# Altium project Apollo2.PrjPCB
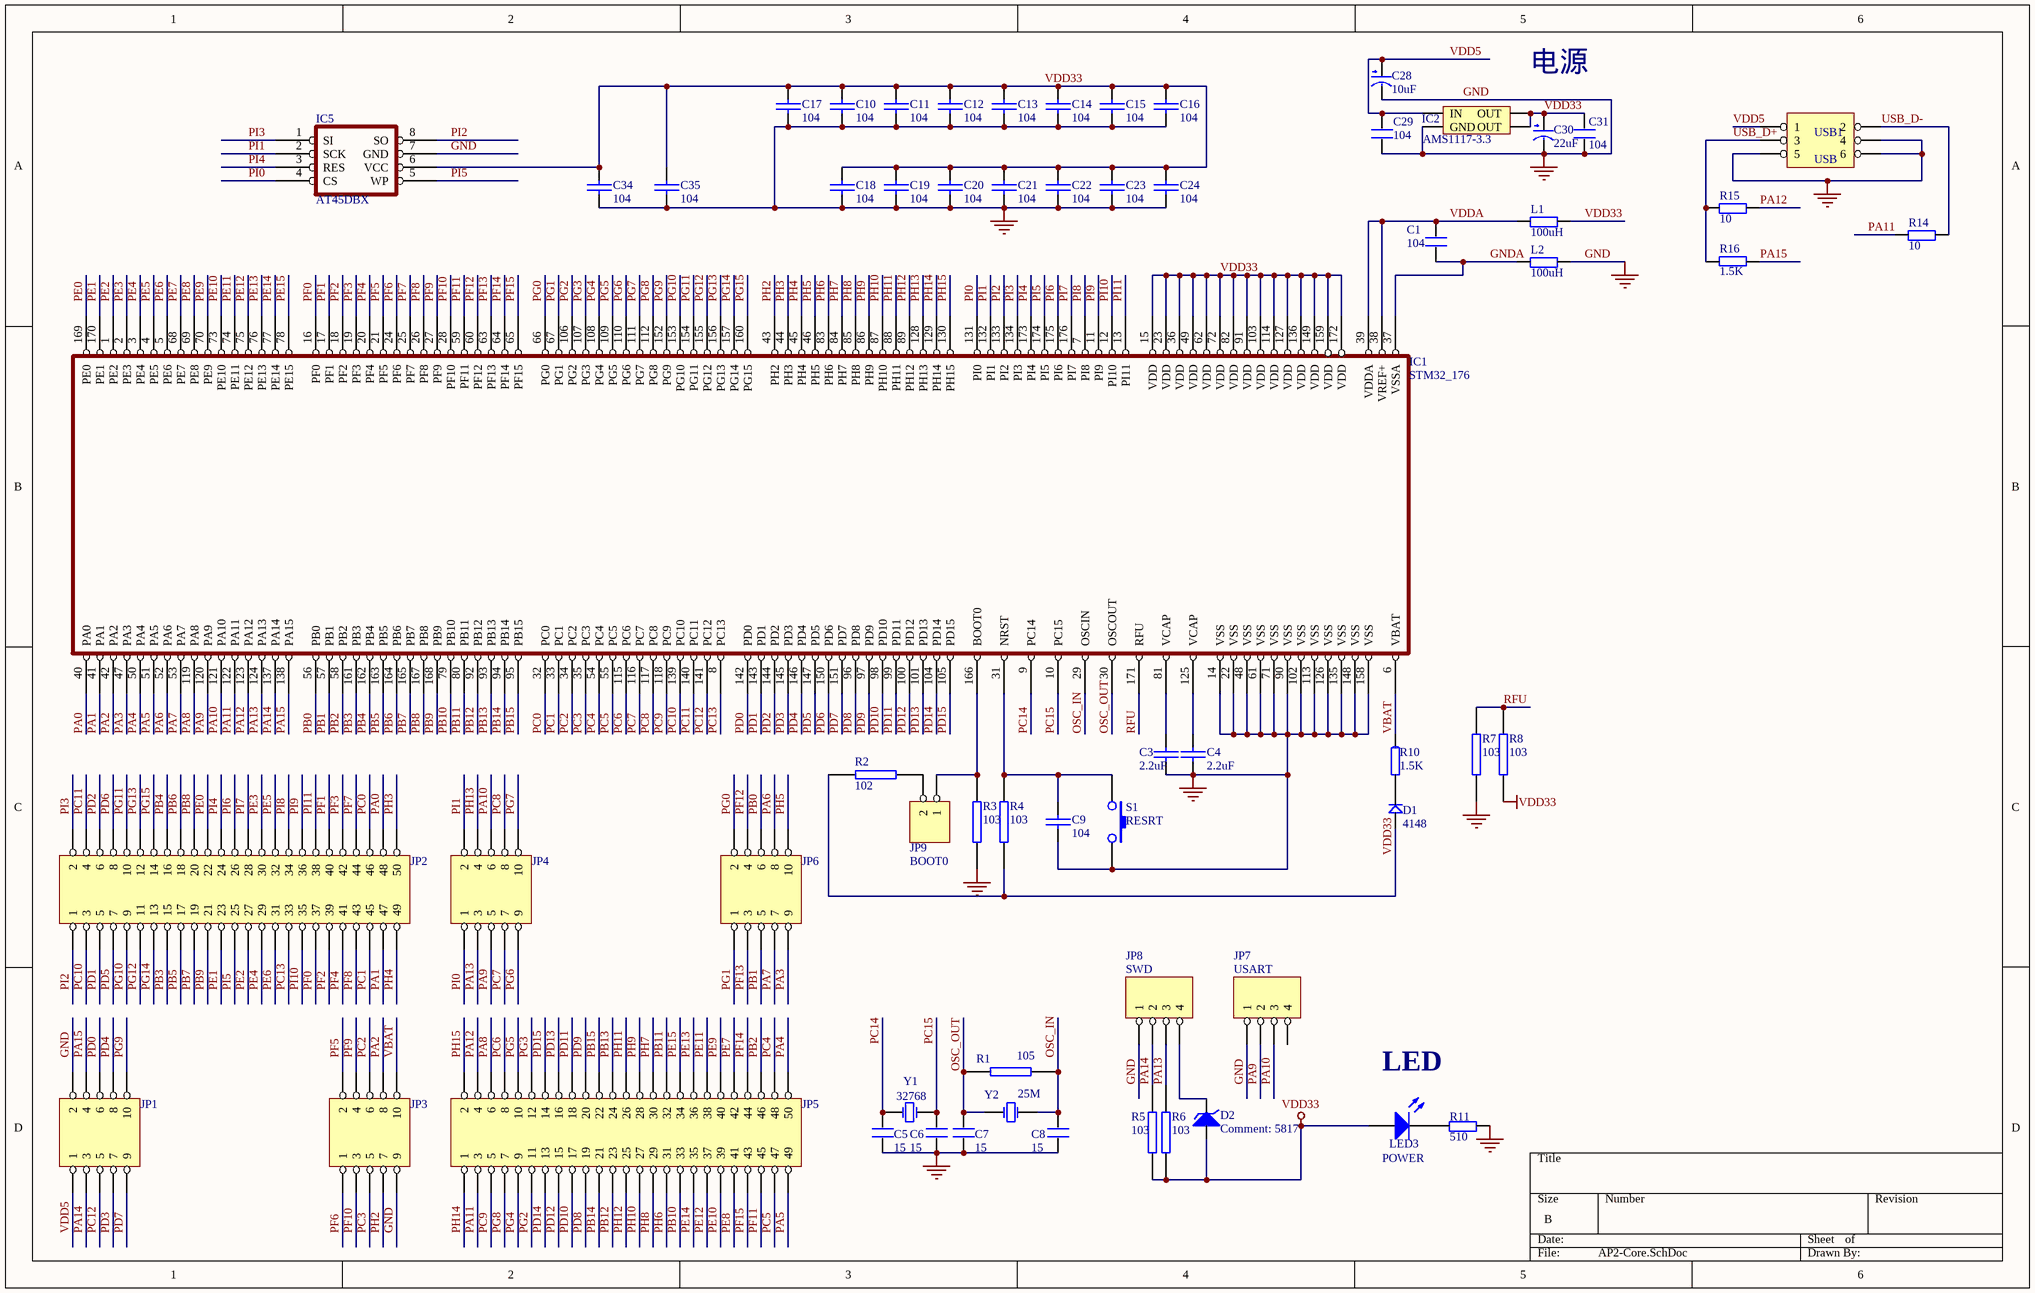
[diagram p0: AP2-Core.SchDoc]
2 sheets, 581 parts. Net scope: global (net labels, ports and power ports of the same name join across sheets).
Board files: AP2-H.PcbDoc, AP2-Core.PcbDoc
Sheets:
  AP2-Core.SchDoc
  AP2-H.SchDoc

## Sheet AP2-Core.SchDoc
size B; SheetNumber: 0; SheetTotal: 0

### Parts
(Parts that share a designator on the sheet are numbered #1, #2 ... from top to bottom, then left to right.)
C1#1  104  [0603P]
C3#1  2.2uF  [3528]
C4#1  2.2uF  [3528]
C5#1  15  [0603P]
C6#1  15  [0603P]
C7#1  15  [0603P]
C8#1  15  [0603P]
C9#1  104  [0603P]
C10#1  104  [0603P]
C11#1  104  [0603P]
C12#1  104  [0603P]
C13#1  104  [0603P]
C14#1  104  [0603P]
C15#1  104  [0603P]
C16  104  [0603P]
C17  104  [0603P]
C18#1  104  [0603P]
C19#1  104  [0603P]
C20#1  104  [0603P]
C21#1  104  [0603P]
C22#1  104  [0603P]
C23#1  104  [0603P]
C24#1  104  [0603P]
C28#1  10uF  [1206C]
C29#1  104  [0603P]
C30#1  22uF  [3528]
C31#1  104  [0603P]
C34#1  104  [0603P]
C35  104  [0603P]
D1#1  4148  [DIODE_SOP]
D2#1  5817  [T5817]
IC1  STM32_176  [LQFP176]
IC2  AMS1117-3.3  [AMS1117]
IC5  AT45DBX  [SOIC-8]
JP1  (no value)
JP2  (no value)
JP3  (no value)
JP4  (no value)
JP5  (no value)
JP6  (no value)
JP7  USART  [SIP3]
JP8  SWD  [SIP4]
JP9  BOOT0
L1#1  100uH  [0805]
L2#1  100uH  [0805]
LED3#1  POWER  [0603P]
R1#1  105  [0603P]
R2#1  102  [0603P]
R3#1  103  [0603P]
R4#1  103  [0603P]
R5#1  103  [0603p]
R6#1  103  [0603P]
R7#1  103  [0603P]
R8#1  103  [0603P]
R10#1  1.5K  [0603P]
R11#1  510  [0603P]
R14#1  10  [0603P]
R15#1  10  [0603P]
R16#1  1.5K  [0603P]
S1  RESRT
USB1#1  USB  [MINI USB D]
Y1#1  32768  [MC-146]
Y2  25M  [XTALV-49USMD]

### Nets
GND: C3#1.2 C4#1.2 C5#1.1 C6#1.1 C7#1.2 C8#1.2 C9#1.2 C10#1.2 C11#1.2 C12#1.2 C13#1.2 C14#1.2 C15#1.2 C16.2 C17.2 C18#1.2 C19#1.2 C20#1.2 C21#1.2 C22#1.2 C23#1.2 C24#1.2 C28#1.2(GND) C29#1.1 C30#1.2(GND) C31#1.1 C34#1.2 C35.2 IC1.14(VSS) IC1.22(VSS) IC1.48(VSS) IC1.61(VSS) IC1.71(VSS) IC1.90(VSS) IC1.102(VSS) IC1.113(VSS) IC1.126(VSS) IC1.135(VSS) IC1.148(VSS) IC1.158(VSS) IC2.1(GND) IC5.7(GND) JP1.2 JP3.9 JP7.1 JP8.1 L2#1.2 R3#1.1 R7#1.1 R11#1.2 S1.2 USB1#1.4 USB1#1.5 USB1#1.6
VDD33: C10#1.1 C11#1.1 C12#1.1 C13#1.1 C14#1.1 C15#1.1 C16.1 C17.1 C18#1.1 C19#1.1 C20#1.1 C21#1.1 C22#1.1 C23#1.1 C24#1.1 C30#1.1(VCC) C31#1.2 C34#1.1 C35.1 D1#1.1 D2#1.A IC1.15(VDD) IC1.23(VDD) IC1.36(VDD) IC1.49(VDD) IC1.62(VDD) IC1.72(VDD) IC1.82(VDD) IC1.91(VDD) IC1.103(VDD) IC1.114(VDD) IC1.127(VDD) IC1.136(VDD) IC1.149(VDD) IC1.159(VDD) IC1.172(VDD) IC2.2(OUT) IC2.4(OUT) IC5.6(VCC) L1#1.2 LED3#1.1(A) R2#1.2 R4#1.1 R5#1.1 R6#1.1 R8#1.1
GNDA: C1#1.1 IC1.37(VSSA) L2#1.1
OSC_IN: C8#1.1 IC1.29(OSCIN) R1#1.2 Y2.1(OSC1)
OSC_OUT: C7#1.1 IC1.30(OSCOUT) R1#1.1 Y2.2(OSC2)
PA0: IC1.40(PA0) JP2.48  [project net CLKOUT]
PA1: IC1.41(PA1) JP2.47  [project net INT]
PA2: IC1.42(PA2) JP3.8
PA3: IC1.47(PA3) JP6.9
PA4: IC1.50(PA4) JP5.50  [project net CS]
PA5: IC1.51(PA5) JP5.49
PA6: IC1.52(PA6) JP6.8
PA7: IC1.53(PA7) JP6.7
PA8: IC1.119(PA8) JP5.6
PA9: IC1.120(PA9) JP4.5 JP7.2
PA10: IC1.121(PA10) JP4.6 JP7.3
PA11: IC1.122(PA11) JP5.3 R14#1.1
PA12: IC1.123(PA12) JP5.4 R15#1.2
PA13: IC1.124(PA13) JP4.3 JP8.3 R6#1.2
PA14: IC1.137(PA14) JP1.3 JP8.2 R5#1.2
PA15: IC1.138(PA15) JP1.4 R16#1.1
PB0: IC1.56(PB0) JP6.6
PB1: IC1.57(PB1) JP6.5
PB2: IC1.58(PB2) JP5.46
PB3: IC1.161(PB3) JP2.15
PB4: IC1.162(PB4) JP2.16
PB5: IC1.163(PB5) JP2.17
PB6: IC1.164(PB6) JP2.18
PB7: IC1.165(PB7) JP2.19
PB8: IC1.167(PB8) JP2.20
PB9: IC1.168(PB9) JP2.21
PB10: IC1.79(PB10) JP5.33
PB11: IC1.80(PB11) JP5.32
PB12: IC1.92(PB12) JP5.23
PB13: IC1.93(PB13) JP5.24
PB14: IC1.94(PB14) JP5.21
PB15: IC1.95(PB15) JP5.22
PC0: IC1.32(PC0) JP2.46
PC1: IC1.33(PC1) JP2.45
PC2: IC1.34(PC2) JP3.6
PC3: IC1.35(PC3) JP3.5
PC4: IC1.54(PC4) JP5.48
PC5: IC1.55(PC5) JP5.47
PC6: IC1.115(PC6) JP5.8
PC7: IC1.116(PC7) JP4.7
PC8: IC1.117(PC8) JP4.8
PC9: IC1.118(PC9) JP5.5
PC10: IC1.139(PC10) JP2.3
PC11: IC1.140(PC11) JP2.4
PC12: IC1.141(PC12) JP1.5
PC13: IC1.8(PC13) JP2.33
PC14: C5#1.2 IC1.9(PC14) Y1#1.1(OSC1)
PC15: C6#1.2 IC1.10(PC15) Y1#1.2(OSC2)
PD0: IC1.142(PD0) JP1.6
PD1: IC1.143(PD1) JP2.5
PD2: IC1.144(PD2) JP2.6
PD3: IC1.145(PD3) JP1.7
PD4: IC1.146(PD4) JP1.8
PD5: IC1.147(PD5) JP2.7
PD6: IC1.150(PD6) JP2.8
PD7: IC1.151(PD7) JP1.9
PD8: IC1.96(PD8) JP5.19
PD9: IC1.97(PD9) JP5.20
PD10: IC1.98(PD10) JP5.17
PD11: IC1.99(PD11) JP5.18
PD12: IC1.100(PD12) JP5.15
PD13: IC1.101(PD13) JP5.16
PD14: IC1.104(PD14) JP5.13
PD15: IC1.105(PD15) JP5.14
PE0: IC1.169(PE0) JP2.22
PE1: IC1.170(PE1) JP2.23
PE2: IC1.1(PE2) JP2.27
PE3: IC1.2(PE3) JP2.30
PE4: IC1.3(PE4) JP2.29
PE5: IC1.4(PE5) JP2.32
PE6: IC1.5(PE6) JP2.31
PE7: IC1.68(PE7) JP5.42
PE8: IC1.69(PE8) JP5.41
PE9: IC1.70(PE9) JP5.40
PE10: IC1.73(PE10) JP5.39
PE11: IC1.74(PE11) JP5.38
PE12: IC1.75(PE12) JP5.37
PE13: IC1.76(PE13) JP5.36
PE14: IC1.77(PE14) JP5.35
PE15: IC1.78(PE15) JP5.34
PF0: IC1.16(PF0) JP2.37
PF1: IC1.17(PF1) JP2.40
PF2: IC1.18(PF2) JP2.39
PF3: IC1.19(PF3) JP2.42
PF4: IC1.20(PF4) JP2.41
PF5: IC1.21(PF5) JP3.2
PF6: IC1.24(PF6) JP3.1
PF7: IC1.25(PF7) JP2.44
PF8: IC1.26(PF8) JP2.43
PF9: IC1.27(PF9) JP3.4
PF10: IC1.28(PF10) JP3.3
PF11: IC1.59(PF11) JP5.45
PF12: IC1.60(PF12) JP6.4
PF13: IC1.63(PF13) JP6.3
PF14: IC1.64(PF14) JP5.44
PF15: IC1.65(PF15) JP5.43
PG0: IC1.66(PG0) JP6.2
PG1: IC1.67(PG1) JP6.1
PG2: IC1.106(PG2) JP5.11
PG3: IC1.107(PG3) JP5.12
PG4: IC1.108(PG4) JP5.9
PG5: IC1.109(PG5) JP5.10
PG6: IC1.110(PG6) JP4.9
PG7: IC1.111(PG7) JP4.10
PG8: IC1.112(PG8) JP5.7
PG9: IC1.152(PG9) JP1.10
PG10: IC1.153(PG10) JP2.9
PG11: IC1.154(PG11) JP2.10
PG12: IC1.155(PG12) JP2.11
PG13: IC1.156(PG13) JP2.12
PG14: IC1.157(PG14) JP2.13
PG15: IC1.160(PG15) JP2.14
PH2: IC1.43(PH2) JP3.7
PH3: IC1.44(PH3) JP2.50
PH4: IC1.45(PH4) JP2.49
PH5: IC1.46(PH5) JP6.10
PH6: IC1.83(PH6) JP5.31
PH7: IC1.84(PH7) JP5.30
PH8: IC1.85(PH8) JP5.29
PH9: IC1.86(PH9) JP5.28
PH10: IC1.87(PH10) JP5.27
PH11: IC1.88(PH11) JP5.26
PH12: IC1.89(PH12) JP5.25
PH13: IC1.128(PH13) JP4.4
PH14: IC1.129(PH14) JP5.1
PH15: IC1.130(PH15) JP5.2
PI0: IC1.131(PI0) IC5.4(CS) JP4.1
PI1: IC1.132(PI1) IC5.2(SCK) JP4.2
PI2: IC1.133(PI2) IC5.8(SO) JP2.1
PI3: IC1.134(PI3) IC5.1(SI) JP2.2
PI4: IC1.173(PI4) IC5.3(RES) JP2.24
PI5: IC1.174(PI5) IC5.5(WP) JP2.25
PI6: IC1.175(PI6) JP2.26
PI7: IC1.176(PI7) JP2.28
PI8: IC1.7(PI8) JP2.34
PI9: IC1.11(PI9) JP2.36
PI10: IC1.12(PI10) JP2.35
PI11: IC1.13(PI11) JP2.38
RFU: IC1.171(RFU) R7#1.2 R8#1.2
USB_D+: R15#1.1 R16#1.2 USB1#1.3
USB_D-: R14#1.2 USB1#1.2
VBAT: IC1.6(VBAT) JP3.10 R10#1.1
VDD5: C28#1.1(VCC) C29#1.2 IC2.3(IN) JP1.1 USB1#1.1
VDDA: C1#1.2 IC1.38(VREF+) IC1.39(VDDA) L1#1.1
NetC3#1_1: C3#1.1 IC1.81(VCAP)
NetC4#1_1: C4#1.1 IC1.125(VCAP)
NetC9#1_1: C9#1.1 IC1.31(NRST) R4#1.2 S1.1
NetD1#1_2: D1#1.2 R10#1.2
NetD2#1_K: D2#1.K JP8.4
NetIC1_166: IC1.166(BOOT0) JP9.1 R3#1.2
NetJP9_2: JP9.2 R2#1.1
NetLED3#1_2: LED3#1.2(K) R11#1.1

Not connected (* = marked no-connect by the designer): JP7 4

### Notes on the sheet
- 电源
- LED

### Library data of the parts
C1#1 C5#1 C6#1 C7#1 C8#1 C29#1 C31#1 = C
C3#1 C4#1 C9#1 C10#1 C11#1 C12#1 C13#1 C14#1 C15#1 C16 C17 C18#1 C19#1 C20#1 C21#1 C22#1 C23#1 C24#1 C34#1 C35 = CAP: Capacitor
C28#1 C30#1 = CAP
D1#1 = D: 1N4148
D2#1 = ZENER4: Zener Diode
IC2 = AMS1117
JP1 JP3 JP4 JP6 = HEADER 5X2
JP2 JP5 = HEADER 25X2
JP7 JP8 = 4 HEADER: 4 Pin Header
JP9 = HEADER 2
L1#1 L2#1 R10#1 R11#1 R14#1 R15#1 R16#1 = R
LED3#1 = LED2: Typical RED, GREEN, YELLOW, AMBER GaAs LED; Published: *; LatestRevisionDate: *; LatestRevisionNote: *; PackageDocument: *; PackageReference: *; Publisher: *
R1#1 R2#1 R3#1 R4#1 R5#1 R6#1 R7#1 R8#1 = RES2
S1 = SW-PB
USB1#1 = HEADER 3X2
Y1#1 Y2 = XTAL: Crystal Oscillator; Published: *; LatestRevisionDate: *; LatestRevisionNote: *; Publisher: *

## Sheet AP2-H.SchDoc: 阿波罗二号工业控制器Apollo2-64MR底板
size A1; Author: 大石头; CompanyName: 东莞市月无声电子设备有限公司; DocumentName: Ap2-64MR; ProjectName: Ap2-64MR
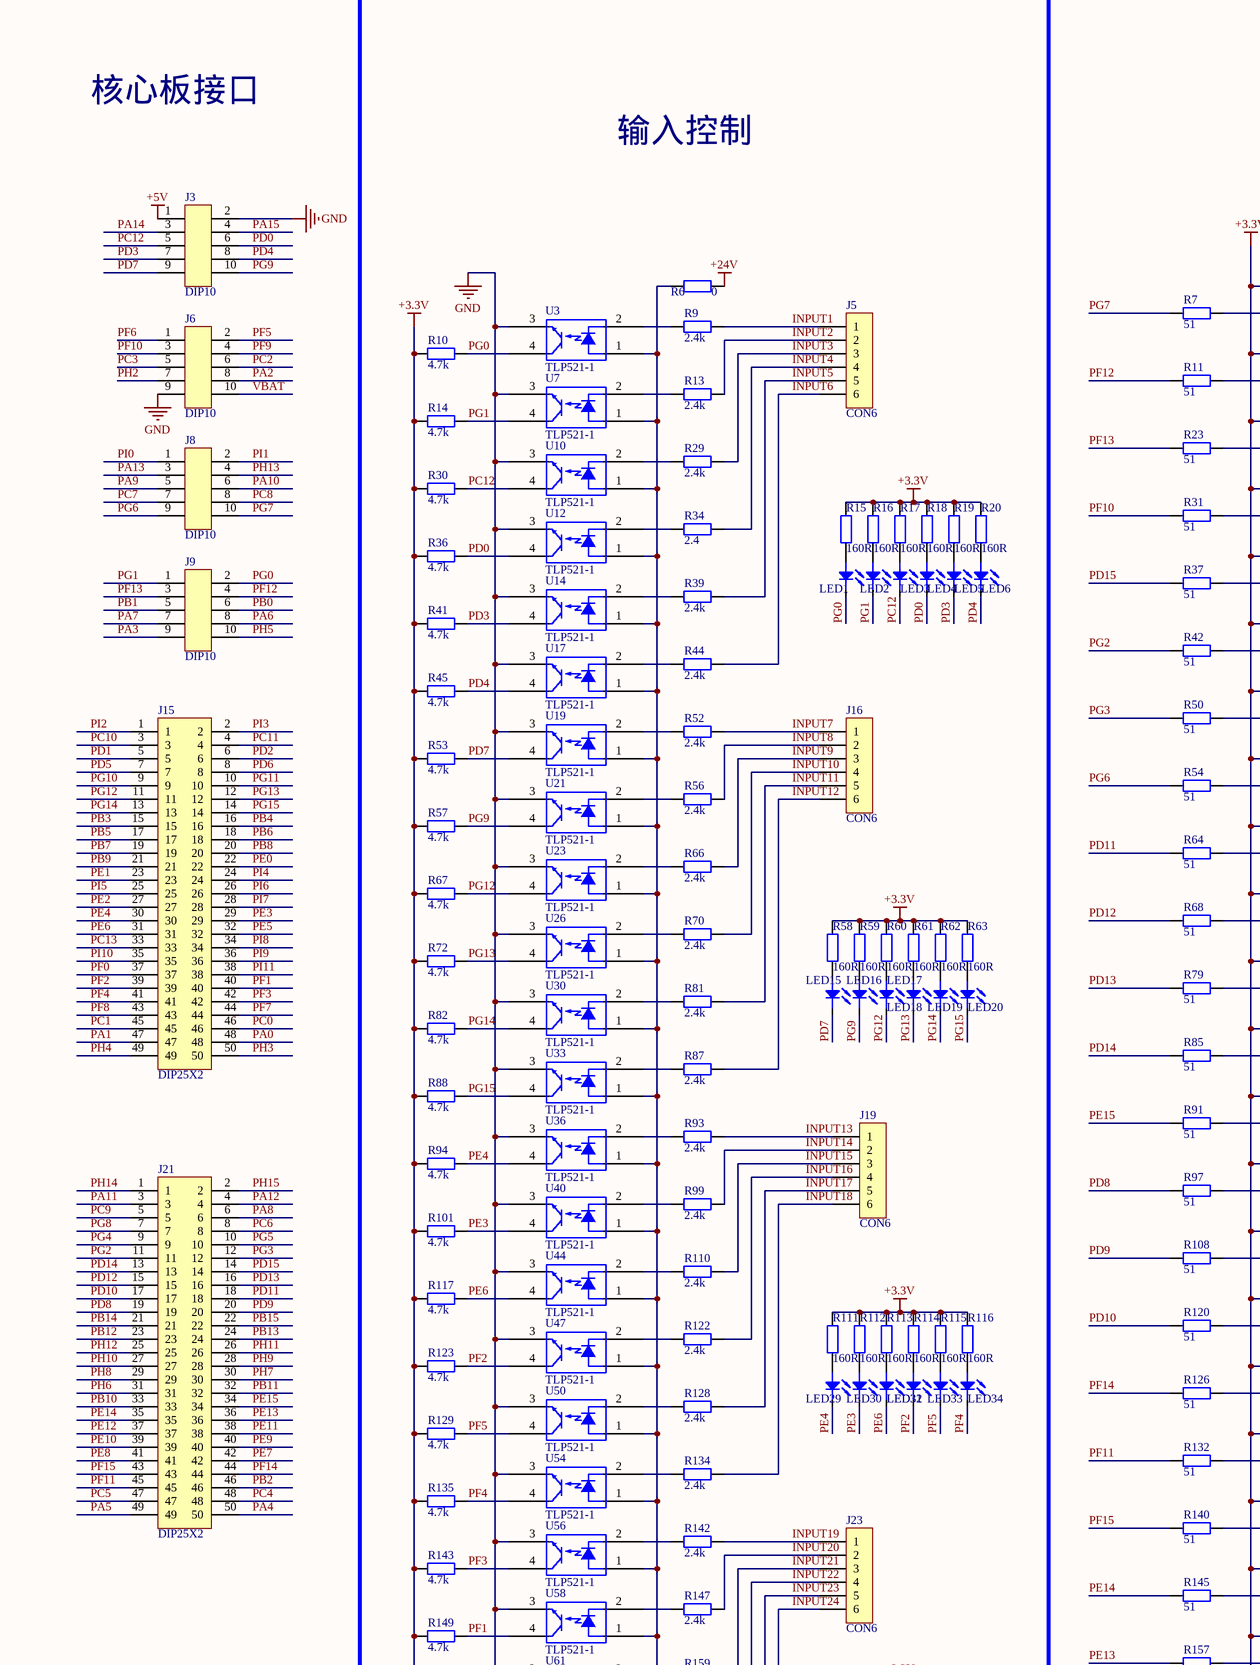
[diagram p1: AP2-H.SchDoc, top left]
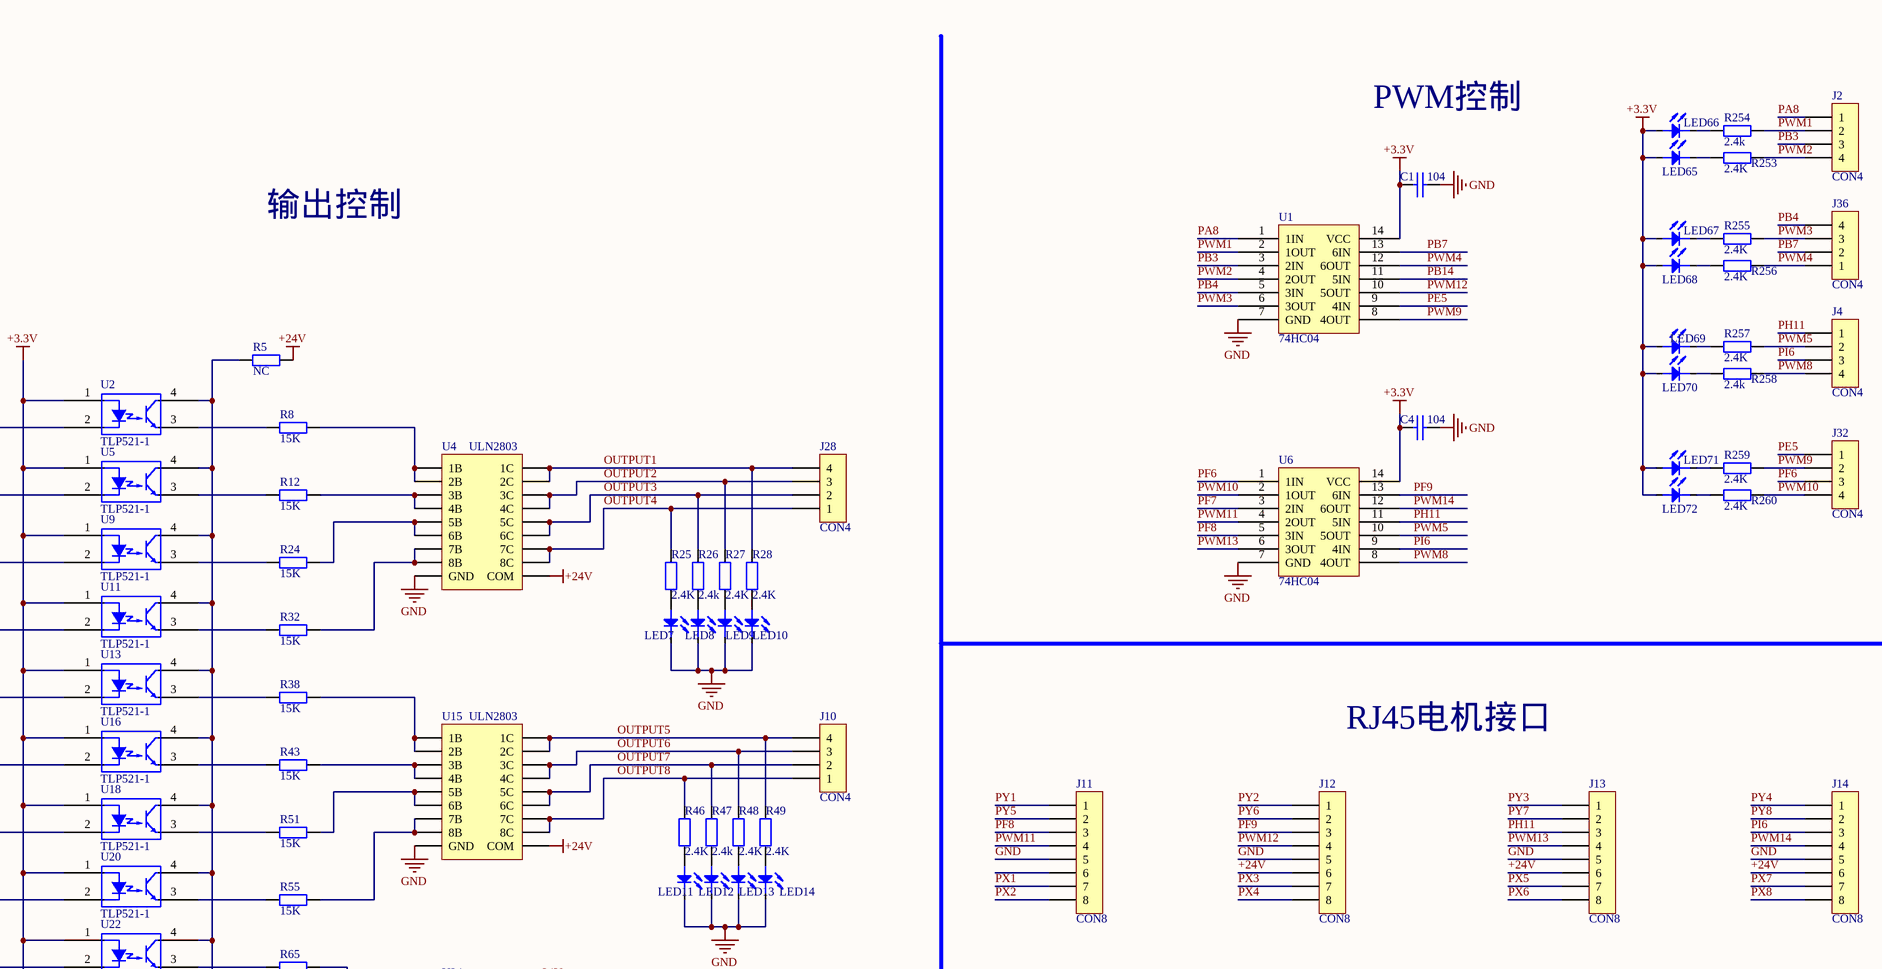
[diagram p2: AP2-H.SchDoc, top middle]
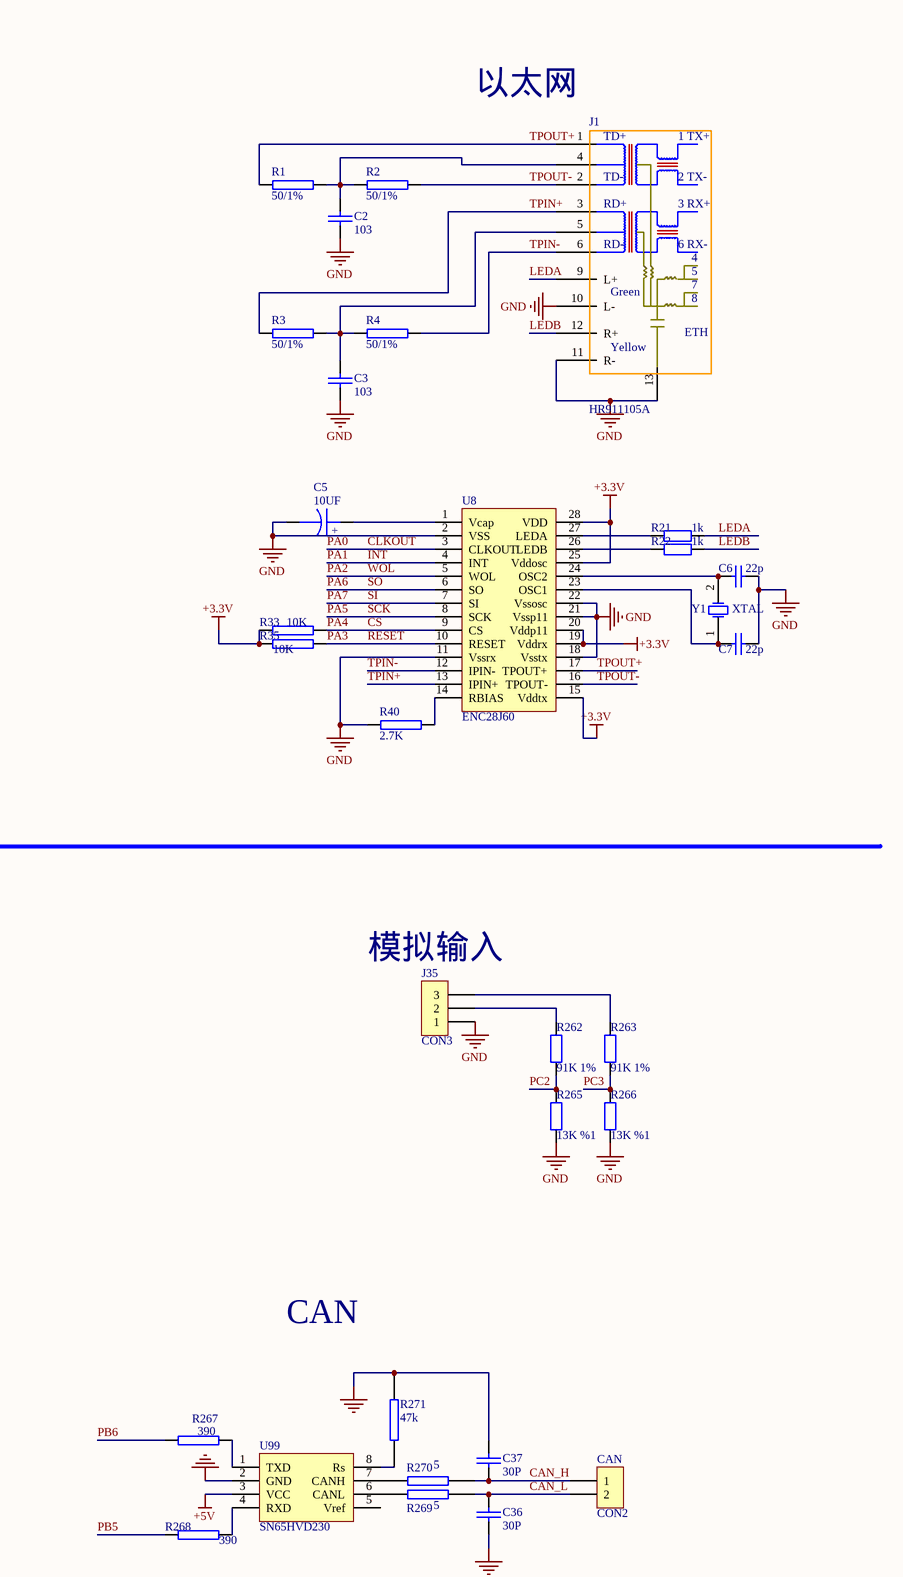
[diagram p3: AP2-H.SchDoc, top right]
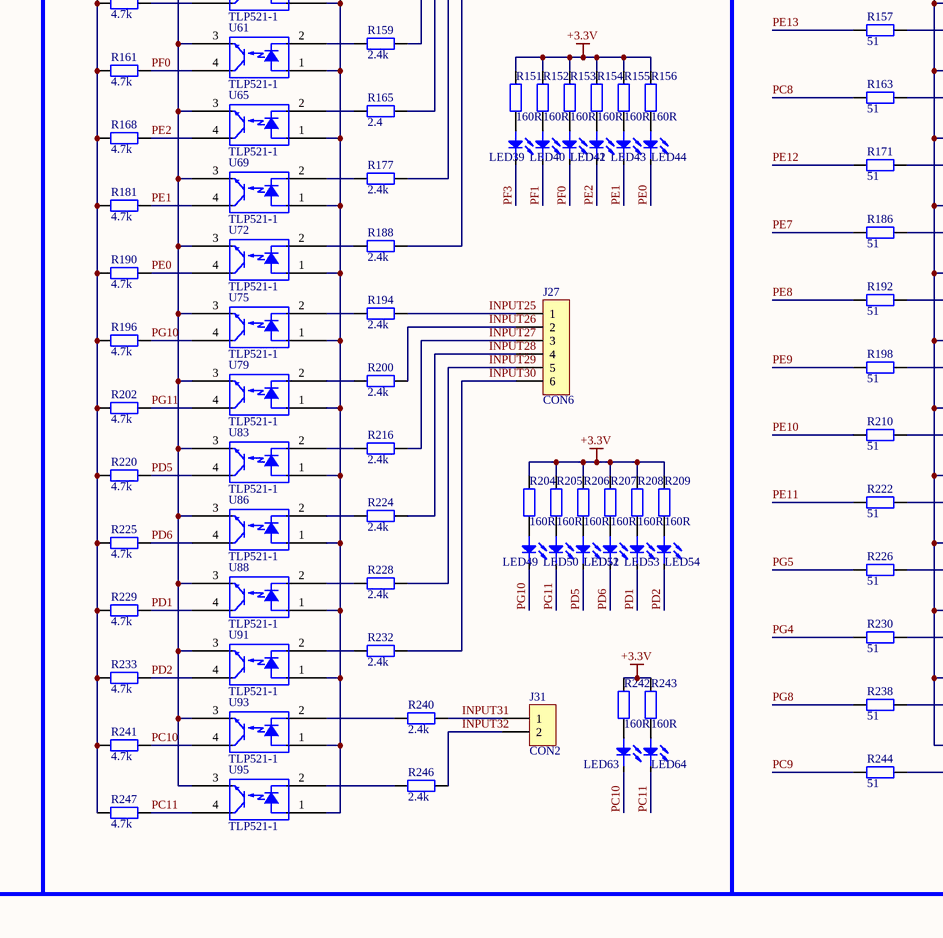
[diagram p4: AP2-H.SchDoc, bottom left]
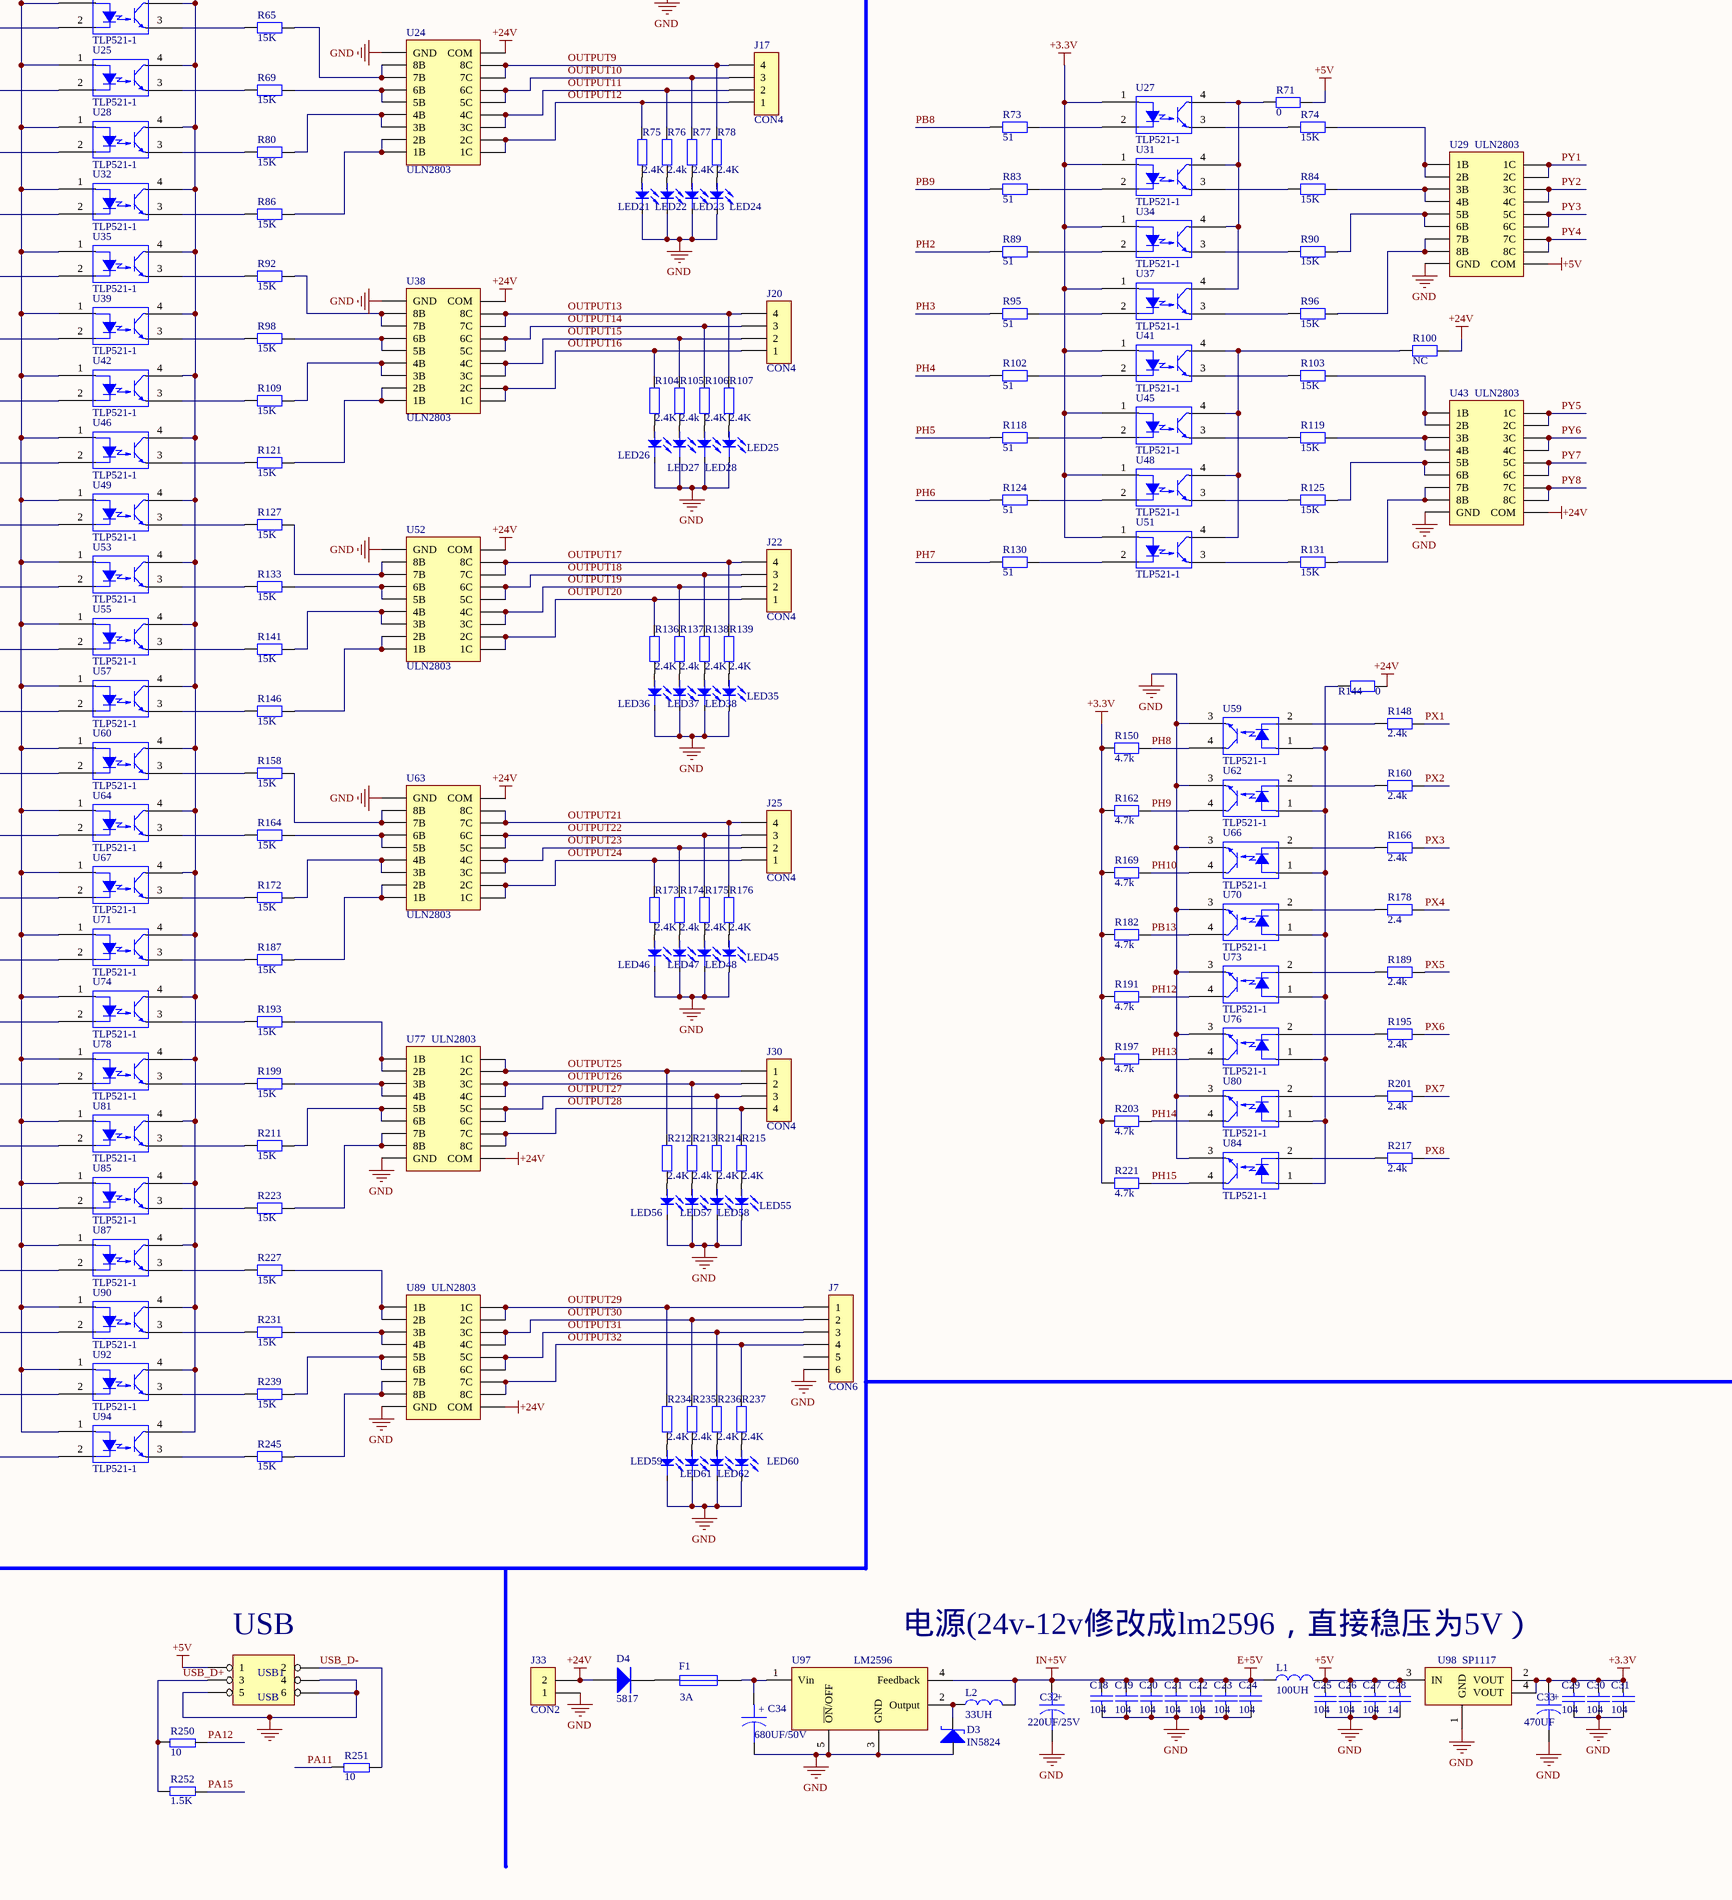
[diagram p5: AP2-H.SchDoc, bottom middle]
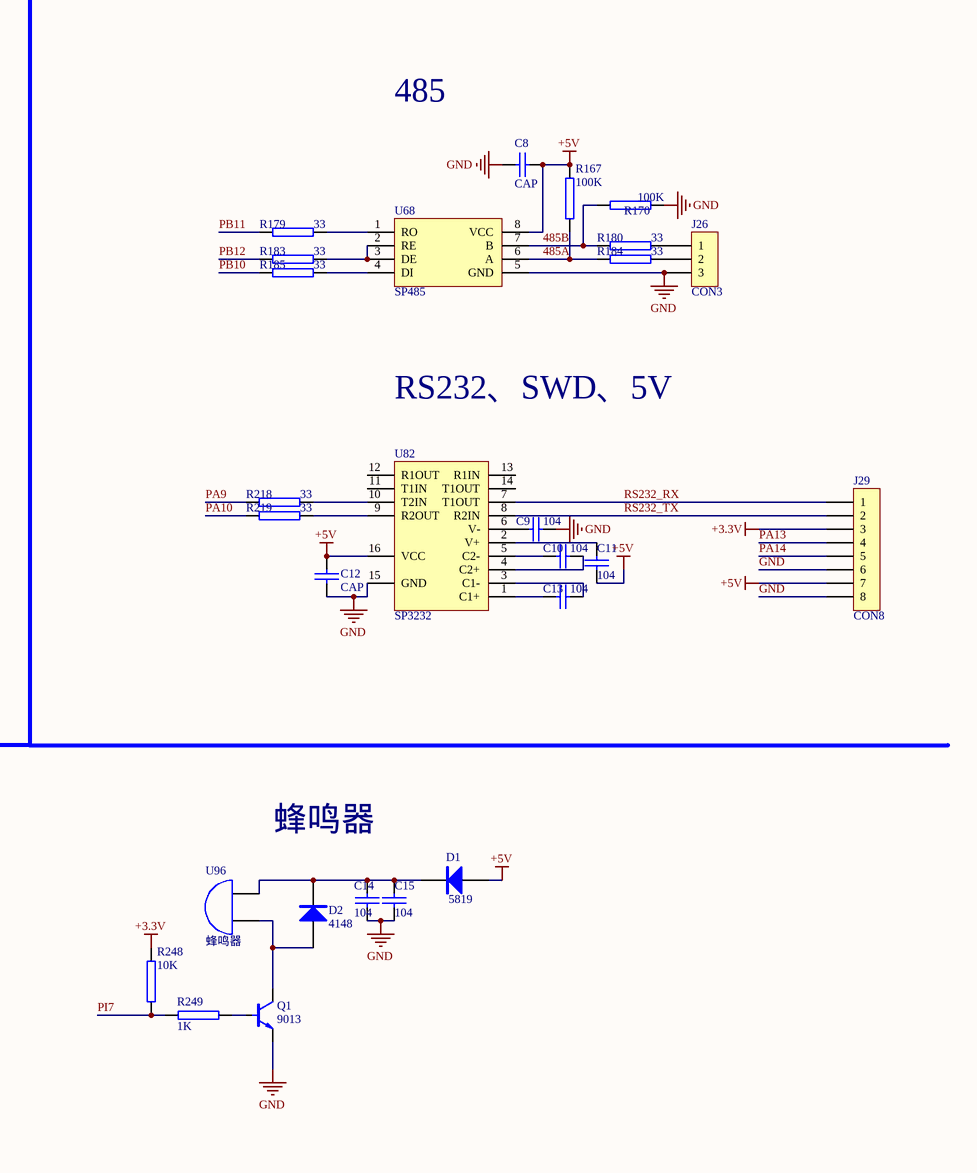
[diagram p6: AP2-H.SchDoc, bottom right]

### Parts
(Parts that share a designator on the sheet are numbered #1, #2 ... from top to bottom, then left to right.)
C1#2  104  [0603]
C2  103  [0603]
C3#2  103  [0603]
C4#2  104  [0603]
C5#2  10UF  [胆电容]
C6#2  22p  [0603]
C7#2  22p  [0603]
C8#2  CAP  [0603]
C9#2  104  [0603]
C10#2  104  [0603]
C11#2  104  [0603]
C12#2  CAP  [0603]
C13#2  104  [0603]
C14#2  104  [0603]
C15#2  104  [0603]
C18#2  104  [0603]
C19#2  104  [0603]
C20#2  104  [0603]
C21#2  104  [0603]
C22#2  104  [0603]
C23#2  104  [0603]
C24#2  104  [0603]
C25  104  [0603]
C26  104  [0603]
C27  104  [0603]
C28#2  14  [0603]
C29#2  104  [0603]
C30#2  104  [0603]
C31#2  104  [0603]
C32  220UF/25V  [固态电容]
C33  470UF  [固态电容]
C34#2  680UF/50V  [固态电容]
C36  30P  [0603]
C37  30P  [0603]
CAN  CON2  [CON2*5]
D1#2  5819  [贴片二极管]
D2#2  4148  [贴片二极管]
D3  IN5824  [贴片二极管]
D4  5817  [贴片二极管]
F1  3A  [自恢复保险丝]
J1  HR911105A  [HR911105A]
J2  CON4  [CON4*5]
J3  DIP10  [DIP2.0-10]
J4  CON4  [CON4*5]
J5  CON6  [CON6*5]
J6  DIP10  [DIP2.0-10]
J7  CON6  [CON6*5]
J8  DIP10  [DIP2.0-10]
J9  DIP10  [DIP2.0-10]
J10  CON4  [CON4*5]
J11  CON8  [立式RJ45]
J12  CON8  [立式RJ45]
J13  CON8  [立式RJ45]
J14  CON8  [立式RJ45]
J15  DIP25X2  [DIP2.0-50]
J16  CON6  [CON6*5]
J17  CON4  [CON4*5]
J19  CON6  [CON6*5]
J20  CON4  [CON4*5]
J21  DIP25X2  [DIP2.0-50]
J22  CON4  [CON4*5]
J23  CON6  [CON6*5]
J25  CON4  [CON4*5]
J26  CON3  [CON3*5]
J27  CON6  [CON6*5]
J28  CON4  [CON4*5]
J29  CON8  [OD-RJ45]
J30  CON4  [CON4*5]
J31  CON2  [CON2*5]
J32  CON4  [CON4*5]
J33  CON2  [CON2*5]
J35  CON3  [CON3*5]
J36  CON4  [CON4*5]
L1#2  100UH  [SMD-48]
L2#2  33UH  [SMD-48]
LED1  LED  [LED2.5]  (value not drawn)
LED2  LED  [LED2.5]  (value not drawn)
LED3#2  LED  [LED2.5]  (value not drawn)
LED4  LED  [LED2.5]  (value not drawn)
LED5  LED  [LED2.5]  (value not drawn)
LED6  LED  [LED2.5]  (value not drawn)
LED7  LED  [LED2.5]  (value not drawn)
LED8  LED  [LED2.5]  (value not drawn)
LED9  LED  [LED2.5]  (value not drawn)
LED10  LED  [LED2.5]  (value not drawn)
LED11  LED  [LED2.5]  (value not drawn)
LED12  LED  [LED2.5]  (value not drawn)
LED13  LED  [LED2.5]  (value not drawn)
LED14  LED  [LED2.5]  (value not drawn)
LED15  LED  [LED2.5]  (value not drawn)
LED16  LED  [LED2.5]  (value not drawn)
LED17  LED  [LED2.5]  (value not drawn)
LED18  LED  [LED2.5]  (value not drawn)
LED19  LED  [LED2.5]  (value not drawn)
LED20  LED  [LED2.5]  (value not drawn)
LED21  LED  [LED2.5]  (value not drawn)
LED22  LED  [LED2.5]  (value not drawn)
LED23  LED  [LED2.5]  (value not drawn)
LED24  LED  [LED2.5]  (value not drawn)
LED25  LED  [LED2.5]  (value not drawn)
LED26  LED  [LED2.5]  (value not drawn)
LED27  LED  [LED2.5]  (value not drawn)
LED28  LED  [LED2.5]  (value not drawn)
LED29  LED  [LED2.5]  (value not drawn)
LED30  LED  [LED2.5]  (value not drawn)
LED31  LED  [LED2.5]  (value not drawn)
LED32  LED  [LED2.5]  (value not drawn)
LED33  LED  [LED2.5]  (value not drawn)
LED34  LED  [LED2.5]  (value not drawn)
LED35  LED  [LED2.5]  (value not drawn)
LED36  LED  [LED2.5]  (value not drawn)
LED37  LED  [LED2.5]  (value not drawn)
LED38  LED  [LED2.5]  (value not drawn)
LED39  LED  [LED2.5]  (value not drawn)
LED40  LED  [LED2.5]  (value not drawn)
LED41  LED  [LED2.5]  (value not drawn)
LED42  LED  [LED2.5]  (value not drawn)
LED43  LED  [LED2.5]  (value not drawn)
LED44  LED  [LED2.5]  (value not drawn)
LED45  LED  [LED2.5]  (value not drawn)
LED46  LED  [LED2.5]  (value not drawn)
LED47  LED  [LED2.5]  (value not drawn)
LED48  LED  [LED2.5]  (value not drawn)
LED49  LED  [LED2.5]  (value not drawn)
LED50  LED  [LED2.5]  (value not drawn)
LED51  LED  [LED2.5]  (value not drawn)
LED52  LED  [LED2.5]  (value not drawn)
LED53  LED  [LED2.5]  (value not drawn)
LED54  LED  [LED2.5]  (value not drawn)
LED55  LED  [LED2.5]  (value not drawn)
LED56  LED  [LED2.5]  (value not drawn)
LED57  LED  [LED2.5]  (value not drawn)
LED58  LED  [LED2.5]  (value not drawn)
LED59  LED  [LED2.5]  (value not drawn)
LED60  LED  [LED2.5]  (value not drawn)
LED61  LED  [LED2.5]  (value not drawn)
LED62  LED  [LED2.5]  (value not drawn)
LED63  LED  [LED2.5]  (value not drawn)
LED64  LED  [LED2.5]  (value not drawn)
LED65  LED  [LED2.5]  (value not drawn)
LED66  LED  [LED2.5]  (value not drawn)
LED67  LED  [LED2.5]  (value not drawn)
LED68  LED  [LED2.5]  (value not drawn)
LED69  LED  [LED2.5]  (value not drawn)
LED70  LED  [LED2.5]  (value not drawn)
LED71  LED  [LED2.5]  (value not drawn)
LED72  LED  [LED2.5]  (value not drawn)
Q1  9013  [SOT23]
R1#2  50/1%  [0603]
R2#2  50/1%  [0603]
R3#2  50/1%  [0603]
R4#2  50/1%  [0603]
R5#2  NC  [0805]
R6#2  0  [0805]
R7#2  51  [0603]
R8#2  15K  [0603]
R9  2.4k  [0603]
R10#2  4.7k  [0603]
R11#2  51  [0603]
R12  15K  [0603]
R13  2.4k  [0603]
R14#2  4.7k  [0603]
R15#2  160R  [0603]
R16#2  160R  [0603]
R17  160R  [0603]
R18  160R  [0603]
R19  160R  [0603]
R20  160R  [0603]
R21  1k  [0603]
R22  1k  [0603]
R23  51  [0603]
R24  15K  [0603]
R25  2.4K  [0603]
R26  2.4k  [0603]
R27  2.4K  [0603]
R28  2.4K  [0603]
R29  2.4k  [0603]
R30  4.7k  [0603]
R31  51  [0603]
R32  15K  [0603]
R33  10K  [0603]
R34  2.4  [0603]
R35  10K  [0603]
R36  4.7k  [0603]
R37  51  [0603]
R38  15K  [0603]
R39  2.4k  [0603]
R40  2.7K  [0603]
R41  4.7k  [0603]
R42  51  [0603]
R43  15K  [0603]
R44  2.4k  [0603]
R45  4.7k  [0603]
R46  2.4K  [0603]
R47  2.4k  [0603]
R48  2.4K  [0603]
R49  2.4K  [0603]
R50  51  [0603]
R51  15K  [0603]
R52  2.4k  [0603]
R53  4.7k  [0603]
R54  51  [0603]
R55  15K  [0603]
R56  2.4k  [0603]
R57  4.7k  [0603]
R58  160R  [0603]
R59  160R  [0603]
R60  160R  [0603]
R61  160R  [0603]
R62  160R  [0603]
R63  160R  [0603]
R64  51  [0603]
R65  15K  [0603]
R66  2.4k  [0603]
R67  4.7k  [0603]
R68  51  [0603]
R69  15K  [0603]
R70  2.4k  [0603]
R71  0  [0805]
R72  4.7k  [0603]
R73  51  [0603]
R74  15K  [0603]
R75  2.4K  [0603]
R76  2.4k  [0603]
R77  2.4K  [0603]
R78  2.4K  [0603]
R79  51  [0603]
R80  15K  [0603]
R81  2.4k  [0603]
R82  4.7k  [0603]
R83  51  [0603]
R84  15K  [0603]
R85  51  [0603]
R86  15K  [0603]
R87  2.4k  [0603]
R88  4.7k  [0603]
R89  51  [0603]
R90  15K  [0603]
R91  51  [0603]
R92  15K  [0603]
R93  2.4k  [0603]
R94  4.7k  [0603]
R95  51  [0603]
R96  15K  [0603]
R97  51  [0603]
R98  15K  [0603]
R99  2.4k  [0603]
R100  NC  [0805]
R101  4.7k  [0603]
R102  51  [0603]
R103  15K  [0603]
R104  2.4K  [0603]
R105  2.4k  [0603]
R106  2.4K  [0603]
R107  2.4K  [0603]
R108  51  [0603]
R109  15K  [0603]
R110  2.4k  [0603]
R111  160R  [0603]
R112  160R  [0603]
R113  160R  [0603]
R114  160R  [0603]
R115  160R  [0603]
R116  160R  [0603]
R117  4.7k  [0603]
R118  51  [0603]
R119  15K  [0603]
R120  51  [0603]
R121  15K  [0603]
R122  2.4k  [0603]
R123  4.7k  [0603]
R124  51  [0603]
R125  15K  [0603]
R126  51  [0603]
R127  15K  [0603]
R128  2.4k  [0603]
R129  4.7k  [0603]
R130  51  [0603]
R131  15K  [0603]
R132  51  [0603]
R133  15K  [0603]
R134  2.4k  [0603]
R135  4.7k  [0603]
R136  2.4K  [0603]
R137  2.4k  [0603]
R138  2.4K  [0603]
R139  2.4K  [0603]
R140  51  [0603]
R141  15K  [0603]
R142  2.4k  [0603]
R143  4.7k  [0603]
R144  0  [0805]
R145  51  [0603]
R146  15K  [0603]
R147  2.4k  [0603]
R148  2.4k  [0603]
R149  4.7k  [0603]
R150  4.7k  [0603]
R151  160R  [0603]
R152  160R  [0603]
R153  160R  [0603]
R154  160R  [0603]
R155  160R  [0603]
R156  160R  [0603]
R157  51  [0603]
R158  15K  [0603]
R159  2.4k  [0603]
R160  2.4k  [0603]
R161  4.7k  [0603]
R162  4.7k  [0603]
R163  51  [0603]
R164  15K  [0603]
R165  2.4  [0603]
R166  2.4k  [0603]
R167  100K  [0603]
R168  4.7k  [0603]
R169  4.7k  [0603]
R170  100K  [0603]
R171  51  [0603]
R172  15K  [0603]
R173  2.4K  [0603]
R174  2.4k  [0603]
R175  2.4K  [0603]
R176  2.4K  [0603]
R177  2.4k  [0603]
R178  2.4  [0603]
R179  33  [0603]
R180  33  [0603]
R181  4.7k  [0603]
R182  4.7k  [0603]
R183  33  [0603]
R184  33  [0603]
R185  33  [0603]
R186  51  [0603]
R187  15K  [0603]
R188  2.4k  [0603]
R189  2.4k  [0603]
R190  4.7k  [0603]
R191  4.7k  [0603]
R192  51  [0603]
R193  15K  [0603]
R194  2.4k  [0603]
R195  2.4k  [0603]
R196  4.7k  [0603]
R197  4.7k  [0603]
R198  51  [0603]
R199  15K  [0603]
R200  2.4k  [0603]
R201  2.4k  [0603]
R202  4.7k  [0603]
R203  4.7k  [0603]
R204  160R  [0603]
R205  160R  [0603]
R206  160R  [0603]
R207  160R  [0603]
R208  160R  [0603]
R209  160R  [0603]
R210  51  [0603]
R211  15K  [0603]
R212  2.4K  [0603]
R213  2.4k  [0603]
R214  2.4K  [0603]
R215  2.4K  [0603]
R216  2.4k  [0603]
R217  2.4k  [0603]
R218  33  [0603]
R219  33  [0603]
R220  4.7k  [0603]
R221  4.7k  [0603]
R222  51  [0603]
R223  15K  [0603]
R224  2.4k  [0603]
R225  4.7k  [0603]
R226  51  [0603]
R227  15K  [0603]
R228  2.4k  [0603]
R229  4.7k  [0603]
R230  51  [0603]
R231  15K  [0603]
R232  2.4k  [0603]
R233  4.7k  [0603]
R234  2.4K  [0603]
R235  2.4k  [0603]
R236  2.4K  [0603]
R237  2.4K  [0603]
R238  51  [0603]
R239  15K  [0603]
R240  2.4k  [0603]
R241  4.7k  [0603]
R242  160R  [0603]
R243  160R  [0603]
R244  51  [0603]
R245  15K  [0603]
R246  2.4k  [0603]
R247  4.7k  [0603]
R248  10K  [0603]
R249  1K  [0603]
R250  10  [0603]
R251  10  [0603]
R252  1.5K  [0603]
R253  2.4K  [0603]
R254  2.4k  [0603]
R255  2.4K  [0603]
R256  2.4K  [0603]
R257  2.4K  [0603]
R258  2.4k  [0603]
R259  2.4K  [0603]
R260  2.4K  [0603]
R262  91K 1%  [0603]
R263  91K 1%  [0603]
R265  13K %1  [0603]
R266  13K %1  [0603]
R267  390  [0603]
R268  390  [0603]
R269  5  [0603]
R270  5  [0603]
R271  47k  [0603]
U1  74HC04  [so-14]
U2  TLP521-1  [PC817]
U3  TLP521-1  [PC817]
U4  ULN2803  [sol18]
U5  TLP521-1  [PC817]
U6  74HC04  [so-14]
U7  TLP521-1  [PC817]
U8  ENC28J60  [SOIC28]
U9  TLP521-1  [PC817]
U10  TLP521-1  [PC817]
U11  TLP521-1  [PC817]
U12  TLP521-1  [PC817]
U13  TLP521-1  [PC817]
U14  TLP521-1  [PC817]
U15  ULN2803  [sol18]
U16  TLP521-1  [PC817]
U17  TLP521-1  [PC817]
U18  TLP521-1  [PC817]
U19  TLP521-1  [PC817]
U20  TLP521-1  [PC817]
U21  TLP521-1  [PC817]
U22  TLP521-1  [PC817]
U23  TLP521-1  [PC817]
U24  ULN2803  [sol18]
U25  TLP521-1  [PC817]
U26  TLP521-1  [PC817]
U27  TLP521-1  [PC817]
U28  TLP521-1  [PC817]
U29  ULN2803  [sol18]
U30  TLP521-1  [PC817]
U31  TLP521-1  [PC817]
U32  TLP521-1  [PC817]
U33  TLP521-1  [PC817]
U34  TLP521-1  [PC817]
U35  TLP521-1  [PC817]
U36  TLP521-1  [PC817]
U37  TLP521-1  [PC817]
U38  ULN2803  [sol18]
U39  TLP521-1  [PC817]
U40  TLP521-1  [PC817]
U41  TLP521-1  [PC817]
U42  TLP521-1  [PC817]
U43  ULN2803  [sol18]
U44  TLP521-1  [PC817]
U45  TLP521-1  [PC817]
U46  TLP521-1  [PC817]
U47  TLP521-1  [PC817]
U48  TLP521-1  [PC817]
U49  TLP521-1  [PC817]
U50  TLP521-1  [PC817]
U51  TLP521-1  [PC817]
U52  ULN2803  [sol18]
U53  TLP521-1  [PC817]
U54  TLP521-1  [PC817]
U55  TLP521-1  [PC817]
U56  TLP521-1  [PC817]
U57  TLP521-1  [PC817]
U58  TLP521-1  [PC817]
U59  TLP521-1  [PC817]
U60  TLP521-1  [PC817]
U61  TLP521-1  [PC817]
U62  TLP521-1  [PC817]
U63  ULN2803  [sol18]
U64  TLP521-1  [PC817]
U65  TLP521-1  [PC817]
U66  TLP521-1  [PC817]
U67  TLP521-1  [PC817]
U68  SP485  [SOP8]
U69  TLP521-1  [PC817]
U70  TLP521-1  [PC817]
U71  TLP521-1  [PC817]
U72  TLP521-1  [PC817]
U73  TLP521-1  [PC817]
U74  TLP521-1  [PC817]
U75  TLP521-1  [PC817]
U76  TLP521-1  [PC817]
U77  ULN2803  [sol18]
U78  TLP521-1  [PC817]
U79  TLP521-1  [PC817]
U80  TLP521-1  [PC817]
U81  TLP521-1  [PC817]
U82  SP3232  [TSSOP16]
U83  TLP521-1  [PC817]
U84  TLP521-1  [PC817]
U85  TLP521-1  [PC817]
U86  TLP521-1  [PC817]
U87  TLP521-1  [PC817]
U88  TLP521-1  [PC817]
U89  ULN2803  [sol18]
U90  TLP521-1  [PC817]
U91  TLP521-1  [PC817]
U92  TLP521-1  [PC817]
U93  TLP521-1  [PC817]
U94  TLP521-1  [PC817]
U95  TLP521-1  [PC817]
U96  蜂鸣器  [蜂鸣器]
U97  LM2596  [TO-263-5]
U98  SP1117  [SOT223]
U99  SN65HVD230  [SOP8]
USB1#2  USB  [USB-B3]
Y1#2  XTAL  [晶振]

### Nets
+3.3V: C1#2.1 C4#2.1 C29#2.1 C30#2.1 C31#2.1 C33.1 J29.3 LED65.A LED66.A LED67.A LED68.A LED69.A LED70.A LED71.A LED72.A R10#2.1 R14#2.1 R15#2.1 R16#2.1 R17.1 R18.1 R19.1 R20.1 R30.1 R33.1 R35.1 R36.1 R41.1 R45.1 R53.1 R57.1 R58.1 R59.1 R60.1 R61.1 R62.1 R63.1 R67.1 R72.1 R82.1 R88.1 R94.1 R101.1 R111.1 R112.1 R113.1 R114.1 R115.1 R116.1 R117.1 R123.1 R129.1 R135.1 R143.1 R149.1 R150.1 R151.1 R152.1 R153.1 R154.1 R155.1 R156.1 R161.1 R162.1 R168.1 R169.1 R181.1 R182.1 R190.1 R191.1 R196.1 R197.1 R202.1 R203.1 R204.1 R205.1 R206.1 R207.1 R208.1 R209.1 R220.1 R221.1 R225.1 R229.1 R233.1 R241.1 R242.1 R243.1 R247.1 R248.2 U1.14(VCC) U2.1(ANODE) U5.1(ANODE) U6.14(VCC) U8.15(Vddtx) U8.19(Vddrx) U8.20(Vddp11) U8.25(Vddosc) U8.28(VDD) U9.1(ANODE) U11.1(ANODE) U13.1(ANODE) U16.1(ANODE) U18.1(ANODE) U20.1(ANODE) U22.1(ANODE) U25.1(ANODE) U27.1(ANODE) U28.1(ANODE) U31.1(ANODE) U32.1(ANODE) U34.1(ANODE) U35.1(ANODE) U37.1(ANODE) U39.1(ANODE) U41.1(ANODE) U42.1(ANODE) U45.1(ANODE) U46.1(ANODE) U48.1(ANODE) U49.1(ANODE) U51.1(ANODE) U53.1(ANODE) U55.1(ANODE) U57.1(ANODE) U60.1(ANODE) U64.1(ANODE) U67.1(ANODE) U71.1(ANODE) U74.1(ANODE) U78.1(ANODE) U81.1(ANODE) U85.1(ANODE) U87.1(ANODE) U90.1(ANODE) U92.1(ANODE) U94.1(ANODE) U98.2(VOUT) U98.4(VOUT)
+5V: C8#2.2 C11#2.2 C12#2.1 C25.1 C26.1 C27.1 C28#2.1 D1#2.A J3.1 J29.7 L1#2.1 R71.2 R167.2 U29.10(COM) U68.8(VCC) U82.16(VCC) U98.3(IN) U99.3(VCC) USB1#2.1
+24V: D4.A J12.6 J13.6 J14.6 J33.2 R5#2.2 R6#2.2 R100.2 R144.2 U4.10(COM) U15.10(COM) U24.10(COM) U38.10(COM) U43.10(COM) U52.10(COM) U63.10(COM) U77.10(COM) U89.10(COM)
E+5V: C18#2.2 C19#2.2 C20#2.2 C21#2.2 C22#2.2 C23#2.2 C24#2.2 C32.1 L1#2.2 L2#2.1 U97.4(Feedback)  [also labelled IN+5V]
GND: C1#2.2 C2.2 C3#2.2 C4#2.2 C5#2.2 C6#2.2 C7#2.2 C8#2.1 C9#2.2 C12#2.2 C14#2.2 C15#2.2 C18#2.1 C19#2.1 C20#2.1 C21#2.1 C22#2.1 C23#2.1 C24#2.1 C25.2 C26.2 C27.2 C28#2.2 C29#2.2 C30#2.2 C31#2.2 C32.2 C33.2 C34#2.2 C36.1 C37.1 D3.A J1.10(L-) J1.11(R-) J1.13 J3.2 J6.9 J7.6 J11.5 J12.5 J13.5 J14.5 J26.3 J29.6 J29.8 J33.1 J35.1 LED7.K LED8.K LED9.K LED10.K LED11.K LED12.K LED13.K LED14.K LED21.K LED22.K LED23.K LED24.K LED25.K LED26.K LED27.K LED28.K LED35.K LED36.K LED37.K LED38.K LED45.K LED46.K LED47.K LED48.K LED55.K LED56.K LED57.K LED58.K LED59.K LED60.K LED61.K LED62.K Q1.2(e) R40.2 R170.2 R265.2 R266.2 R271.2 U1.7(GND) U3.3(EMIT) U4.9(GND) U6.7(GND) U7.3(EMIT) U8.2(VSS) U8.11(Vssrx) U8.18(Vsstx) U8.21(Vssp11) U8.22(Vssosc) U10.3(EMIT) U12.3(EMIT) U14.3(EMIT) U15.9(GND) U17.3(EMIT) U19.3(EMIT) U21.3(EMIT) U23.3(EMIT) U24.9(GND) U26.3(EMIT) U29.9(GND) U30.3(EMIT) U33.3(EMIT) U36.3(EMIT) U38.9(GND) U40.3(EMIT) U43.9(GND) U44.3(EMIT) U47.3(EMIT) U50.3(EMIT) U52.9(GND) U54.3(EMIT) U56.3(EMIT) U58.3(EMIT) U59.3(EMIT) U61.3(EMIT) U62.3(EMIT) U63.9(GND) U65.3(EMIT) U66.3(EMIT) U68.5(GND) U69.3(EMIT) U70.3(EMIT) U72.3(EMIT) U73.3(EMIT) U75.3(EMIT) U76.3(EMIT) U77.9(GND) U79.3(EMIT) U80.3(EMIT) U82.15(GND) U83.3(EMIT) U84.3(EMIT) U86.3(EMIT) U88.3(EMIT) U89.9(GND) U91.3(EMIT) U93.3(EMIT) U95.3(EMIT) U97.3(GND) U97.5(~{ON}/OFF) U98.1(GND) U99.2(GND) USB1#2.4 USB1#2.5 USB1#2.6
485A: R167.1 R184.1 U68.6(A)
485B: R170.1 R180.1 U68.7(B)
CAN_H: C37.2 CAN.1 R270.1
CAN_L: C36.2 CAN.2 R269.1
CLKOUT: J15.48 U8.3(CLKOUT)  [also labelled PA0]
CS: J21.50 R33.2 U8.9(CS)  [also labelled PA4]
INPUT1: J5.1 R9.2
INPUT2: J5.2 R13.2
INPUT3: J5.3 R29.2
INPUT4: J5.4 R34.2
INPUT5: J5.5 R39.2
INPUT6: J5.6 R44.2
INPUT7: J16.1 R52.2
INPUT8: J16.2 R56.2
INPUT9: J16.3 R66.2
INPUT10: J16.4 R70.2
INPUT11: J16.5 R81.2
INPUT12: J16.6 R87.2
INPUT13: J19.1 R93.2
INPUT14: J19.2 R99.2
INPUT15: J19.3 R110.2
INPUT16: J19.4 R122.2
INPUT17: J19.5 R128.2
INPUT18: J19.6 R134.2
INPUT19: J23.1 R142.2
INPUT20: J23.2 R147.2
INPUT21: J23.3 R159.2
INPUT22: J23.4 R165.2
INPUT23: J23.5 R177.2
INPUT24: J23.6 R188.2
INPUT25: J27.1 R194.2
INPUT26: J27.2 R200.2
INPUT27: J27.3 R216.2
INPUT28: J27.4 R224.2
INPUT29: J27.5 R228.2
INPUT30: J27.6 R232.2
INPUT31: J31.1 R240.2
INPUT32: J31.2 R246.2
INT: J15.47 U8.4(INT)  [also labelled PA1]
LEDA: J1.9(L+) R21.2
LEDB: J1.12(R+) R22.2
OUTPUT1: J28.4 R28.1 U4.17(2C) U4.18(1C)
OUTPUT2: J28.3 R27.1 U4.15(4C) U4.16(3C)
OUTPUT3: J28.2 R26.1 U4.13(6C) U4.14(5C)
OUTPUT4: J28.1 R25.1 U4.11(8C) U4.12(7C)
OUTPUT5: J10.4 R49.1 U15.17(2C) U15.18(1C)
OUTPUT6: J10.3 R48.1 U15.15(4C) U15.16(3C)
OUTPUT7: J10.2 R47.1 U15.13(6C) U15.14(5C)
OUTPUT8: J10.1 R46.1 U15.11(8C) U15.12(7C)
OUTPUT9: J17.4 R78.1 U24.11(8C) U24.12(7C)
OUTPUT10: J17.3 R77.1 U24.13(6C) U24.14(5C)
OUTPUT11: J17.2 R76.1 U24.15(4C) U24.16(3C)
OUTPUT12: J17.1 R75.1 U24.17(2C) U24.18(1C)
OUTPUT13: J20.4 R107.1 U38.11(8C) U38.12(7C)
OUTPUT14: J20.3 R106.1 U38.13(6C) U38.14(5C)
OUTPUT15: J20.2 R105.1 U38.15(4C) U38.16(3C)
OUTPUT16: J20.1 R104.1 U38.17(2C) U38.18(1C)
OUTPUT17: J22.4 R139.1 U52.11(8C) U52.12(7C)
OUTPUT18: J22.3 R138.1 U52.13(6C) U52.14(5C)
OUTPUT19: J22.2 R137.1 U52.15(4C) U52.16(3C)
OUTPUT20: J22.1 R136.1 U52.17(2C) U52.18(1C)
OUTPUT21: J25.4 R176.1 U63.11(8C) U63.12(7C)
OUTPUT22: J25.3 R175.1 U63.13(6C) U63.14(5C)
OUTPUT23: J25.2 R174.1 U63.15(4C) U63.16(3C)
OUTPUT24: J25.1 R173.1 U63.17(2C) U63.18(1C)
OUTPUT25: J30.1 R212.1 U77.17(2C) U77.18(1C)
OUTPUT26: J30.2 R213.1 U77.15(4C) U77.16(3C)
OUTPUT27: J30.3 R214.1 U77.13(6C) U77.14(5C)
OUTPUT28: J30.4 R215.1 U77.11(8C) U77.12(7C)
OUTPUT29: J7.1 R234.1 U89.17(2C) U89.18(1C)
OUTPUT30: J7.2 R235.1 U89.15(4C) U89.16(3C)
OUTPUT31: J7.3 R236.1 U89.13(6C) U89.14(5C)
OUTPUT32: J7.4 R237.1 U89.11(8C) U89.12(7C)
PA2: J6.8 U8.5(WOL)  [also labelled WOL]
PA3: J9.9 R35.2 U8.10(RESET)  [also labelled RESET]
PA5: J21.49 U8.8(SCK)  [also labelled SCK]
PA6: J9.8 U8.6(SO)  [also labelled SO]
PA7: J9.7 U8.7(SI)  [also labelled SI]
PA8: J2.1 J21.6 U1.1(1IN)
PA9: J8.5 R218.1
PA10: J8.6 R219.1
PA11: J21.3 R251.1
PA12: J21.4 R250.2
PA13: J8.3 J29.4
PA14: J3.3 J29.5
PA15: J3.4 R252.1
PB0: J9.6
PB1: J9.5
PB2: J21.46
PB3: J2.3 J15.15 U1.3(2IN)
PB4: J15.16 J36.4 U1.5(3IN)
PB5: J15.17 R268.1
PB6: J15.18 R267.1
PB7: J15.19 J36.2 U1.13(6IN)
PB8: J15.20 R73.1
PB9: J15.21 R83.1
PB10: J21.33 R185.1
PB11: J21.32 R179.1
PB12: J21.23 R183.1
PB13: J21.24 R182.2 U70.4(COL)
PB14: J21.21 U1.11(5IN)
PB15: J21.22
PC0: J15.46
PC1: J15.45
PC2: J6.6 R262.2 R265.1
PC3: J6.5 R263.2 R266.1
PC4: J21.48
PC5: J21.47
PC6: J21.8
PC7: J8.7
PC8: J8.8 R163.1
PC9: J21.5 R244.1
PC10: J15.3 LED63.K R241.2 U93.4(COL)
PC11: J15.4 LED64.K R247.2 U95.4(COL)
PC12: J3.5 LED3#2.K R30.2 U10.4(COL)
PC13: J15.33
PD0: J3.6 LED4.K R36.2 U12.4(COL)
PD1: J15.5 LED53.K R229.2 U88.4(COL)
PD2: J15.6 LED54.K R233.2 U91.4(COL)
PD3: J3.7 LED5.K R41.2 U14.4(COL)
PD4: J3.8 LED6.K R45.2 U17.4(COL)
PD5: J15.7 LED52.K R220.2 U83.4(COL)
PD6: J15.8 LED51.K R225.2 U86.4(COL)
PD7: J3.9 LED15.K R53.2 U19.4(COL)
PD8: J21.19 R97.1
PD9: J21.20 R108.1
PD10: J21.17 R120.1
PD11: J21.18 R64.1
PD12: J21.15 R68.1
PD13: J21.16 R79.1
PD14: J21.13 R85.1
PD15: J21.14 R37.1
PE0: J15.22 LED44.K R190.2 U72.4(COL)
PE1: J15.23 LED43.K R181.2 U69.4(COL)
PE2: J15.27 LED42.K R168.2 U65.4(COL)
PE3: J15.29 LED30.K R101.2 U40.4(COL)
PE4: J15.30 LED29.K R94.2 U36.4(COL)
PE5: J15.32 J32.1 U1.9(4IN)
PE6: J15.31 LED32.K R117.2 U44.4(COL)
PE7: J21.42 R186.1
PE8: J21.41 R192.1
PE9: J21.40 R198.1
PE10: J21.39 R210.1
PE11: J21.38 R222.1
PE12: J21.37 R171.1
PE13: J21.36 R157.1
PE14: J21.35 R145.1
PE15: J21.34 R91.1
PF0: J15.37 LED41.K R161.2 U61.4(COL)
PF1: J15.40 LED40.K R149.2 U58.4(COL)
PF2: J15.39 LED31.K R123.2 U47.4(COL)
PF3: J15.42 LED39.K R143.2 U56.4(COL)
PF4: J15.41 LED34.K R135.2 U54.4(COL)
PF5: J6.2 LED33.K R129.2 U50.4(COL)
PF6: J6.1 J32.3 U6.1(1IN)
PF7: J15.44 U6.3(2IN)
PF8: J11.3 J15.43 U6.5(3IN)
PF9: J6.4 J12.3 U6.13(6IN)
PF10: J6.3 R31.1
PF11: J21.45 R132.1
PF12: J9.4 R11#2.1
PF13: J9.3 R23.1
PF14: J21.44 R126.1
PF15: J21.43 R140.1
PG0: J9.2 LED1.K R10#2.2 U3.4(COL)
PG1: J9.1 LED2.K R14#2.2 U7.4(COL)
PG2: J21.11 R42.1
PG3: J21.12 R50.1
PG4: J21.9 R230.1
PG5: J21.10 R226.1
PG6: J8.9 R54.1
PG7: J8.10 R7#2.1
PG8: J21.7 R238.1
PG9: J3.10 LED16.K R57.2 U21.4(COL)
PG10: J15.9 LED49.K R196.2 U75.4(COL)
PG11: J15.10 LED50.K R202.2 U79.4(COL)
PG12: J15.11 LED17.K R67.2 U23.4(COL)
PG13: J15.12 LED18.K R72.2 U26.4(COL)
PG14: J15.13 LED19.K R82.2 U30.4(COL)
PG15: J15.14 LED20.K R88.2 U33.4(COL)
PH2: J6.7 R89.1
PH3: J15.50 R95.1
PH4: J15.49 R102.1
PH5: J9.10 R118.1
PH6: J21.31 R124.1
PH7: J21.30 R130.1
PH8: J21.29 R150.2 U59.4(COL)
PH9: J21.28 R162.2 U62.4(COL)
PH10: J21.27 R169.2 U66.4(COL)
PH11: J4.1 J13.3 J21.26 U6.11(5IN)
PH12: J21.25 R191.2 U73.4(COL)
PH13: J8.4 R197.2 U76.4(COL)
PH14: J21.1 R203.2 U80.4(COL)
PH15: J21.2 R221.2 U84.4(COL)
PI0: J8.1
PI1: J8.2
PI2: J15.1
PI3: J15.2
PI4: J15.24
PI5: J15.25
PI6: J4.3 J14.3 J15.26 U6.9(4IN)
PI7: J15.28 R248.1 R249.1
PI8: J15.34
PI9: J15.36
PI10: J15.35
PI11: J15.38
PWM1: J2.2 R254.2 U1.2(1OUT)
PWM2: J2.4 R253.2 U1.4(2OUT)
PWM3: J36.3 R255.2 U1.6(3OUT)
PWM4: J36.1 R256.2 U1.12(6OUT)
PWM5: J4.2 R257.2 U6.10(5OUT)
PWM8: J4.4 R258.2 U6.8(4OUT)
PWM9: J32.2 R259.2 U1.8(4OUT)
PWM10: J32.4 R260.2 U6.2(1OUT)
PWM11: J11.4 U6.4(2OUT)
PWM12: J12.4 U1.10(5OUT)
PWM13: J13.4 U6.6(3OUT)
PWM14: J14.4 U6.12(6OUT)
PX1: J11.7 R148.2
PX2: J11.8 R160.2
PX3: J12.7 R166.2
PX4: J12.8 R178.2
PX5: J13.7 R189.2
PX6: J13.8 R195.2
PX7: J14.7 R201.2
PX8: J14.8 R217.2
PY1: J11.1 U29.17(2C) U29.18(1C)
PY2: J12.1 U29.15(4C) U29.16(3C)
PY3: J13.1 U29.13(6C) U29.14(5C)
PY4: J14.1 U29.11(8C) U29.12(7C)
PY5: J11.2 U43.17(2C) U43.18(1C)
PY6: J12.2 U43.15(4C) U43.16(3C)
PY7: J13.2 U43.13(6C) U43.14(5C)
PY8: J14.2 U43.11(8C) U43.12(7C)
RS232_RX: J29.1 U82.7(T1OUT)
RS232_TX: J29.2 U82.8(R2IN)
TPIN+: J1.3 R3#2.2 U8.13(IPIN+)
TPIN-: J1.6 R4#2.1 U8.12(IPIN-)
TPOUT+: J1.1 R1#2.2 U8.17(TPOUT+)
TPOUT-: J1.2 R2#2.1 U8.16(TPOUT-)
USB_D+: R250.1 R252.2 USB1#2.3
USB_D-: R251.2 USB1#2.2
VBAT: J6.10
NetC2_1: C2.1 J1.4 R1#2.1 R2#2.2
NetC3#2_1: C3#2.1 J1.5 R3#2.1 R4#2.2
NetC5#2_1: C5#2.1 U8.1(Vcap)
NetC6#2_1: C6#2.1 U8.24(OSC2) Y1#2.2(OSC2)
NetC7#2_1: C7#2.1 U8.23(OSC1) Y1#2.1(OSC1)
NetC9#2_1: C9#2.1 U82.6(V-)
NetC10#2_1: C10#2.1 U82.5(C2-)
NetC10#2_2: C10#2.2 U82.4(C2+)
NetC11#2_1: C11#2.1 U82.2(V+)
NetC13#2_1: C13#2.1 U82.1(C1+)
NetC13#2_2: C13#2.2 U82.3(C1-)
NetC14#2_1: C14#2.1 C15#2.1 D1#2.K D2#2.K U96.2(B)
NetC34#2_1: C34#2.1 F1.2 U97.1(Vin)
NetD2#2_A: D2#2.A Q1.3(c) U96.1(A)
NetD3_K: D3.K L2#2.2 U97.2(Output)
NetD4_K: D4.K F1.1
NetJ26_1: J26.1 R180.2
NetJ26_2: J26.2 R184.2
NetJ35_2: J35.2 R262.1
NetJ35_3: J35.3 R263.1
NetLED1_A: LED1.A R15#2.2
NetLED2_A: LED2.A R16#2.2
NetLED3#2_A: LED3#2.A R17.2
NetLED4_A: LED4.A R18.2
NetLED5_A: LED5.A R19.2
NetLED6_A: LED6.A R20.2
NetLED7_A: LED7.A R25.2
NetLED8_A: LED8.A R26.2
NetLED9_A: LED9.A R27.2
NetLED10_A: LED10.A R28.2
NetLED11_A: LED11.A R46.2
NetLED12_A: LED12.A R47.2
NetLED13_A: LED13.A R48.2
NetLED14_A: LED14.A R49.2
NetLED15_A: LED15.A R58.2
NetLED16_A: LED16.A R59.2
NetLED17_A: LED17.A R60.2
NetLED18_A: LED18.A R61.2
NetLED19_A: LED19.A R62.2
NetLED20_A: LED20.A R63.2
NetLED21_A: LED21.A R75.2
NetLED22_A: LED22.A R76.2
NetLED23_A: LED23.A R77.2
NetLED24_A: LED24.A R78.2
NetLED25_A: LED25.A R107.2
NetLED26_A: LED26.A R104.2
NetLED27_A: LED27.A R105.2
NetLED28_A: LED28.A R106.2
NetLED29_A: LED29.A R111.2
NetLED30_A: LED30.A R112.2
NetLED31_A: LED31.A R114.2
NetLED32_A: LED32.A R113.2
NetLED33_A: LED33.A R115.2
NetLED34_A: LED34.A R116.2
NetLED35_A: LED35.A R139.2
NetLED36_A: LED36.A R136.2
NetLED37_A: LED37.A R137.2
NetLED38_A: LED38.A R138.2
NetLED39_A: LED39.A R151.2
NetLED40_A: LED40.A R152.2
NetLED41_A: LED41.A R153.2
NetLED42_A: LED42.A R154.2
NetLED43_A: LED43.A R155.2
NetLED44_A: LED44.A R156.2
NetLED45_A: LED45.A R176.2
NetLED46_A: LED46.A R173.2
NetLED47_A: LED47.A R174.2
NetLED48_A: LED48.A R175.2
NetLED49_A: LED49.A R204.2
NetLED50_A: LED50.A R205.2
NetLED51_A: LED51.A R207.2
NetLED52_A: LED52.A R206.2
NetLED53_A: LED53.A R208.2
NetLED54_A: LED54.A R209.2
NetLED55_A: LED55.A R215.2
NetLED56_A: LED56.A R212.2
NetLED57_A: LED57.A R213.2
NetLED58_A: LED58.A R214.2
NetLED59_A: LED59.A R235.2
NetLED60_A: LED60.A R237.2
NetLED61_A: LED61.A R234.2
NetLED62_A: LED62.A R236.2
NetLED63_A: LED63.A R242.2
NetLED64_A: LED64.A R243.2
NetLED65_K: LED65.K R253.1
NetLED66_K: LED66.K R254.1
NetLED67_K: LED67.K R255.1
NetLED68_K: LED68.K R256.1
NetLED69_K: LED69.K R257.1
NetLED70_K: LED70.K R258.1
NetLED71_K: LED71.K R259.1
NetLED72_K: LED72.K R260.1
NetQ1_1: Q1.1(b) R249.2
NetR5#2_1: R5#2.1 U2.4(COL) U5.4(COL) U9.4(COL) U11.4(COL) U13.4(COL) U16.4(COL) U18.4(COL) U20.4(COL) U22.4(COL) U25.4(COL) U28.4(COL) U32.4(COL) U35.4(COL) U39.4(COL) U42.4(COL) U46.4(COL) U49.4(COL) U53.4(COL) U55.4(COL) U57.4(COL) U60.4(COL) U64.4(COL) U67.4(COL) U71.4(COL) U74.4(COL) U78.4(COL) U81.4(COL) U85.4(COL) U87.4(COL) U90.4(COL) U92.4(COL) U94.4(COL)
NetR6#2_1: R6#2.1 U3.1(ANODE) U7.1(ANODE) U10.1(ANODE) U12.1(ANODE) U14.1(ANODE) U17.1(ANODE) U19.1(ANODE) U21.1(ANODE) U23.1(ANODE) U26.1(ANODE) U30.1(ANODE) U33.1(ANODE) U36.1(ANODE) U40.1(ANODE) U44.1(ANODE) U47.1(ANODE) U50.1(ANODE) U54.1(ANODE) U56.1(ANODE) U58.1(ANODE) U61.1(ANODE) U65.1(ANODE) U69.1(ANODE) U72.1(ANODE) U75.1(ANODE) U79.1(ANODE) U83.1(ANODE) U86.1(ANODE) U88.1(ANODE) U91.1(ANODE) U93.1(ANODE) U95.1(ANODE)
NetR7#2_2: R7#2.2 U2.2(CATH)
NetR8#2_1: R8#2.1 U2.3(EMIT)
NetR8#2_2: R8#2.2 U4.1(1B) U4.2(2B)
NetR9_1: R9.1 U3.2(CATH)
NetR11#2_2: R11#2.2 U5.2(CATH)
NetR12_1: R12.1 U5.3(EMIT)
NetR12_2: R12.2 U4.3(3B) U4.4(4B)
NetR13_1: R13.1 U7.2(CATH)
NetR21_1: R21.1 U8.27(LEDA)
NetR22_1: R22.1 U8.26(LEDB)
NetR23_2: R23.2 U9.2(CATH)
NetR24_1: R24.1 U9.3(EMIT)
NetR24_2: R24.2 U4.5(5B) U4.6(6B)
NetR29_1: R29.1 U10.2(CATH)
NetR31_2: R31.2 U11.2(CATH)
NetR32_1: R32.1 U11.3(EMIT)
NetR32_2: R32.2 U4.7(7B) U4.8(8B)
NetR34_1: R34.1 U12.2(CATH)
NetR37_2: R37.2 U13.2(CATH)
NetR38_1: R38.1 U13.3(EMIT)
NetR38_2: R38.2 U15.1(1B) U15.2(2B)
NetR39_1: R39.1 U14.2(CATH)
NetR40_1: R40.1 U8.14(RBIAS)
NetR42_2: R42.2 U16.2(CATH)
NetR43_1: R43.1 U16.3(EMIT)
NetR43_2: R43.2 U15.3(3B) U15.4(4B)
NetR44_1: R44.1 U17.2(CATH)
NetR50_2: R50.2 U18.2(CATH)
NetR51_1: R51.1 U18.3(EMIT)
NetR51_2: R51.2 U15.5(5B) U15.6(6B)
NetR52_1: R52.1 U19.2(CATH)
NetR54_2: R54.2 U20.2(CATH)
NetR55_1: R55.1 U20.3(EMIT)
NetR55_2: R55.2 U15.7(7B) U15.8(8B)
NetR56_1: R56.1 U21.2(CATH)
NetR64_2: R64.2 U22.2(CATH)
NetR65_1: R65.1 U22.3(EMIT)
NetR65_2: R65.2 U24.7(7B) U24.8(8B)
NetR66_1: R66.1 U23.2(CATH)
NetR68_2: R68.2 U25.2(CATH)
NetR69_1: R69.1 U25.3(EMIT)
NetR69_2: R69.2 U24.5(5B) U24.6(6B)
NetR70_1: R70.1 U26.2(CATH)
NetR71_1: R71.1 U27.4(COL) U31.4(COL) U34.4(COL) U37.4(COL)
NetR73_2: R73.2 U27.2(CATH)
NetR74_1: R74.1 U27.3(EMIT)
NetR74_2: R74.2 U29.1(1B) U29.2(2B)
NetR79_2: R79.2 U28.2(CATH)
NetR80_1: R80.1 U28.3(EMIT)
NetR80_2: R80.2 U24.3(3B) U24.4(4B)
NetR81_1: R81.1 U30.2(CATH)
NetR83_2: R83.2 U31.2(CATH)
NetR84_1: R84.1 U31.3(EMIT)
NetR84_2: R84.2 U29.3(3B) U29.4(4B)
NetR85_2: R85.2 U32.2(CATH)
NetR86_1: R86.1 U32.3(EMIT)
NetR86_2: R86.2 U24.1(1B) U24.2(2B)
NetR87_1: R87.1 U33.2(CATH)
NetR89_2: R89.2 U34.2(CATH)
NetR90_1: R90.1 U34.3(EMIT)
NetR90_2: R90.2 U29.5(5B) U29.6(6B)
NetR91_2: R91.2 U35.2(CATH)
NetR92_1: R92.1 U35.3(EMIT)
NetR92_2: R92.2 U38.7(7B) U38.8(8B)
NetR93_1: R93.1 U36.2(CATH)
NetR95_2: R95.2 U37.2(CATH)
NetR96_1: R96.1 U37.3(EMIT)
NetR96_2: R96.2 U29.7(7B) U29.8(8B)
NetR97_2: R97.2 U39.2(CATH)
NetR98_1: R98.1 U39.3(EMIT)
NetR98_2: R98.2 U38.5(5B) U38.6(6B)
NetR99_1: R99.1 U40.2(CATH)
NetR100_1: R100.1 U41.4(COL) U45.4(COL) U48.4(COL) U51.4(COL)
NetR102_2: R102.2 U41.2(CATH)
NetR103_1: R103.1 U41.3(EMIT)
NetR103_2: R103.2 U43.1(1B) U43.2(2B)
NetR108_2: R108.2 U42.2(CATH)
NetR109_1: R109.1 U42.3(EMIT)
NetR109_2: R109.2 U38.3(3B) U38.4(4B)
NetR110_1: R110.1 U44.2(CATH)
NetR118_2: R118.2 U45.2(CATH)
NetR119_1: R119.1 U45.3(EMIT)
NetR119_2: R119.2 U43.3(3B) U43.4(4B)
NetR120_2: R120.2 U46.2(CATH)
NetR121_1: R121.1 U46.3(EMIT)
NetR121_2: R121.2 U38.1(1B) U38.2(2B)
NetR122_1: R122.1 U47.2(CATH)
NetR124_2: R124.2 U48.2(CATH)
NetR125_1: R125.1 U48.3(EMIT)
NetR125_2: R125.2 U43.5(5B) U43.6(6B)
NetR126_2: R126.2 U49.2(CATH)
NetR127_1: R127.1 U49.3(EMIT)
NetR127_2: R127.2 U52.7(7B) U52.8(8B)
NetR128_1: R128.1 U50.2(CATH)
NetR130_2: R130.2 U51.2(CATH)
NetR131_1: R131.1 U51.3(EMIT)
NetR131_2: R131.2 U43.7(7B) U43.8(8B)
NetR132_2: R132.2 U53.2(CATH)
NetR133_1: R133.1 U53.3(EMIT)
NetR133_2: R133.2 U52.5(5B) U52.6(6B)
NetR134_1: R134.1 U54.2(CATH)
NetR140_2: R140.2 U55.2(CATH)
NetR141_1: R141.1 U55.3(EMIT)
NetR141_2: R141.2 U52.3(3B) U52.4(4B)
NetR142_1: R142.1 U56.2(CATH)
NetR144_1: R144.1 U59.1(ANODE) U62.1(ANODE) U66.1(ANODE) U70.1(ANODE) U73.1(ANODE) U76.1(ANODE) U80.1(ANODE) U84.1(ANODE)
NetR145_2: R145.2 U57.2(CATH)
NetR146_1: R146.1 U57.3(EMIT)
NetR146_2: R146.2 U52.1(1B) U52.2(2B)
NetR147_1: R147.1 U58.2(CATH)
NetR148_1: R148.1 U59.2(CATH)
NetR157_2: R157.2 U60.2(CATH)
NetR158_1: R158.1 U60.3(EMIT)
NetR158_2: R158.2 U63.7(7B) U63.8(8B)
NetR159_1: R159.1 U61.2(CATH)
NetR160_1: R160.1 U62.2(CATH)
NetR163_2: R163.2 U64.2(CATH)
NetR164_1: R164.1 U64.3(EMIT)
NetR164_2: R164.2 U63.5(5B) U63.6(6B)
NetR165_1: R165.1 U65.2(CATH)
NetR166_1: R166.1 U66.2(CATH)
NetR171_2: R171.2 U67.2(CATH)
NetR172_1: R172.1 U67.3(EMIT)
NetR172_2: R172.2 U63.3(3B) U63.4(4B)
NetR177_1: R177.1 U69.2(CATH)
NetR178_1: R178.1 U70.2(CATH)
NetR179_2: R179.2 U68.1(RO)
NetR183_2: R183.2 U68.2(RE) U68.3(DE)
NetR185_2: R185.2 U68.4(DI)
NetR186_2: R186.2 U71.2(CATH)
NetR187_1: R187.1 U71.3(EMIT)
NetR187_2: R187.2 U63.1(1B) U63.2(2B)
NetR188_1: R188.1 U72.2(CATH)
NetR189_1: R189.1 U73.2(CATH)
NetR192_2: R192.2 U74.2(CATH)
NetR193_1: R193.1 U74.3(EMIT)
NetR193_2: R193.2 U77.1(1B) U77.2(2B)
NetR194_1: R194.1 U75.2(CATH)
NetR195_1: R195.1 U76.2(CATH)
NetR198_2: R198.2 U78.2(CATH)
NetR199_1: R199.1 U78.3(EMIT)
NetR199_2: R199.2 U77.3(3B) U77.4(4B)
NetR200_1: R200.1 U79.2(CATH)
NetR201_1: R201.1 U80.2(CATH)
NetR210_2: R210.2 U81.2(CATH)
NetR211_1: R211.1 U81.3(EMIT)
NetR211_2: R211.2 U77.5(5B) U77.6(6B)
NetR216_1: R216.1 U83.2(CATH)
NetR217_1: R217.1 U84.2(CATH)
NetR218_2: R218.2 U82.10(T2IN)
NetR219_2: R219.2 U82.9(R2OUT)
NetR222_2: R222.2 U85.2(CATH)
NetR223_1: R223.1 U85.3(EMIT)
NetR223_2: R223.2 U77.7(7B) U77.8(8B)
NetR224_1: R224.1 U86.2(CATH)
NetR226_2: R226.2 U87.2(CATH)
NetR227_1: R227.1 U87.3(EMIT)
NetR227_2: R227.2 U89.1(1B) U89.2(2B)
NetR228_1: R228.1 U88.2(CATH)
NetR230_2: R230.2 U90.2(CATH)
NetR231_1: R231.1 U90.3(EMIT)
NetR231_2: R231.2 U89.3(3B) U89.4(4B)
NetR232_1: R232.1 U91.2(CATH)
NetR238_2: R238.2 U92.2(CATH)
NetR239_1: R239.1 U92.3(EMIT)
NetR239_2: R239.2 U89.5(5B) U89.6(6B)
NetR240_1: R240.1 U93.2(CATH)
NetR244_2: R244.2 U94.2(CATH)
NetR245_1: R245.1 U94.3(EMIT)
NetR245_2: R245.2 U89.7(7B) U89.8(8B)
NetR246_1: R246.1 U95.2(CATH)
NetR267_2: R267.2 U99.1(TXD)
NetR268_2: R268.2 U99.4(RXD)
NetR269_2: R269.2 U99.6(CANL)
NetR270_2: R270.2 U99.7(CANH)
NetR271_1: R271.1 U99.8(Rs)

Not connected (* = marked no-connect by the designer): J7 5; J11 6; U82 11(T1IN) 12(R1OUT) 13(R1IN) 14(T1OUT); U99 5(Vref)

### Notes on the sheet
- PWM控制
- 以太网
- 核心板接口
- 输入控制
- 输出控制
- RJ45电机接口
- (near J35) 模拟输入
- CAN
- 485
- RS232、SWD、5V
- 蜂鸣器
- (near USB1#2) USB
- 电源(24v-12v修改成lm2596，直接稳压为5V）
- (in symbol CAPACITOR POL) +
- (in symbol HR911105A) TD+; 1 TX+; TD-; 2 TX-; RD+; 3 RX+; RD-; 6 RX-; 7; Green; 8; ETH; Yellow

### Library data of the parts
C1#2 C2 C3#2 C4#2 C8#2 C9#2 C10#2 C11#2 C12#2 C13#2 C14#2 C15#2 C18#2 C19#2 C20#2 C21#2 C22#2 C23#2 C24#2 C25-C27 C28#2 C29#2 C30#2 C31#2 = CAP: Capacitor
C5#2 C32 C33 C34#2 = CAPACITOR POL: Capacitor
C6#2 C7#2 = Cap: Capacitor; Value: 100pF; Published: 8-Jun-2000; LatestRevisionDate: 17-Jul-2002; LatestRevisionNote: Re-released for DXP Platform.; PackageReference: RAD-0.3; Publisher: Altium Limited
C36 C37 = CAP
D1#2 D2#2 D4 = 二极管
D3 = 肖特基二极管
F1 = Fuse 1: Fuse; Published: 8-Jun-2000; LatestRevisionDate: 17-Jul-2002; LatestRevisionNote: Re-released for DXP Platform.; PackageReference: PIN-W2/E2.8; Publisher: Altium Limited
J3 J6 J8 J9 = DIP5X2: Set Position: 0.5; Published: 8-Jun-2000; LatestRevisionDate: 17-Jul-2002; LatestRevisionNote: Re-released for DXP Platform.; PackageReference: AXIAL-0.6; Publisher: Altium Limited
L1#2 L2#2 = L1
Q1 = NPN
R1#2 R2#2 R3#2 R4#2 R33 R35 R40 R167 R170 R179 R180 R183-R185 R218 R219 R248 R249 R267-R271 = RES2
R5#2 R6#2 R7#2 R8#2 R9 R10#2 R11#2 R12 R13 R14#2 R15#2 R16#2 R17-R20 R23-R32 R34 R36-R39 R41-R166 R168 R169 R171-R178 R181 R182 R186-R217 R220-R247 R253-R260 R262 R263 R265 R266 = Res2: Resistor; Value: 1K; Published: 8-Jun-2000; LatestRevisionDate: 17-Jul-2002; LatestRevisionNote: Re-released for DXP Platform.; PackageReference: AXIAL-0.4; Publisher: Altium Limited
R21 R22 = Res2: Resistor; Published: 8-Jun-2000; LatestRevisionDate: 17-Jul-2002; LatestRevisionNote: Re-released for DXP Platform.; PackageReference: AXIAL-0.4; Publisher: Altium Limited; Value: 1K
R250-R252 = R
U2 U3 U5 U7 U9-U14 U16-U23 U25-U28 U30-U37 U39-U42 U44-U51 U53-U62 U64-U67 U69-U76 U78-U81 U83-U88 U90-U95 = TLP521-1: Single NPN PhotoTransistor OptoCoupler.
U82 = SP3232EEA
USB1#2 = HEADER 3X2
Y1#2 = XTAL: Crystal Oscillator; Published: 8-Jun-2000; LatestRevisionDate: 17-Jul-2002; LatestRevisionNote: Re-released for DXP Platform.; PackageReference: R38; Publisher: Altium Limited

## Nets that join several sheets
GND: AP2-Core (54 pins), AP2-H (151 pins)
CLKOUT: AP2-Core (IC1.40 JP2.48), AP2-H (J15.48 U8.3)
CS: AP2-Core (IC1.50 JP5.50), AP2-H (J21.50 R33.2 U8.9)
INT: AP2-Core (IC1.41 JP2.47), AP2-H (J15.47 U8.4)
PA2: AP2-Core (IC1.42 JP3.8), AP2-H (J6.8 U8.5)
PA3: AP2-Core (IC1.47 JP6.9), AP2-H (J9.9 R35.2 U8.10)
PA5: AP2-Core (IC1.51 JP5.49), AP2-H (J21.49 U8.8)
PA6: AP2-Core (IC1.52 JP6.8), AP2-H (J9.8 U8.6)
PA7: AP2-Core (IC1.53 JP6.7), AP2-H (J9.7 U8.7)
PA8: AP2-Core (IC1.119 JP5.6), AP2-H (J2.1 J21.6 U1.1)
PA9: AP2-Core (IC1.120 JP4.5 JP7.2), AP2-H (J8.5 R218.1)
PA10: AP2-Core (IC1.121 JP4.6 JP7.3), AP2-H (J8.6 R219.1)
PA11: AP2-Core (IC1.122 JP5.3 R14#1.1), AP2-H (J21.3 R251.1)
PA12: AP2-Core (IC1.123 JP5.4 R15#1.2), AP2-H (J21.4 R250.2)
PA13: AP2-Core (IC1.124 JP4.3 JP8.3 R6#1.2), AP2-H (J8.3 J29.4)
PA14: AP2-Core (IC1.137 JP1.3 JP8.2 R5#1.2), AP2-H (J3.3 J29.5)
PA15: AP2-Core (IC1.138 JP1.4 R16#1.1), AP2-H (J3.4 R252.1)
PB0: AP2-Core (IC1.56 JP6.6), AP2-H (J9.6)
PB1: AP2-Core (IC1.57 JP6.5), AP2-H (J9.5)
PB2: AP2-Core (IC1.58 JP5.46), AP2-H (J21.46)
PB3: AP2-Core (IC1.161 JP2.15), AP2-H (J2.3 J15.15 U1.3)
PB4: AP2-Core (IC1.162 JP2.16), AP2-H (J15.16 J36.4 U1.5)
PB5: AP2-Core (IC1.163 JP2.17), AP2-H (J15.17 R268.1)
PB6: AP2-Core (IC1.164 JP2.18), AP2-H (J15.18 R267.1)
PB7: AP2-Core (IC1.165 JP2.19), AP2-H (J15.19 J36.2 U1.13)
PB8: AP2-Core (IC1.167 JP2.20), AP2-H (J15.20 R73.1)
PB9: AP2-Core (IC1.168 JP2.21), AP2-H (J15.21 R83.1)
PB10: AP2-Core (IC1.79 JP5.33), AP2-H (J21.33 R185.1)
PB11: AP2-Core (IC1.80 JP5.32), AP2-H (J21.32 R179.1)
PB12: AP2-Core (IC1.92 JP5.23), AP2-H (J21.23 R183.1)
PB13: AP2-Core (IC1.93 JP5.24), AP2-H (J21.24 R182.2 U70.4)
PB14: AP2-Core (IC1.94 JP5.21), AP2-H (J21.21 U1.11)
PB15: AP2-Core (IC1.95 JP5.22), AP2-H (J21.22)
PC0: AP2-Core (IC1.32 JP2.46), AP2-H (J15.46)
PC1: AP2-Core (IC1.33 JP2.45), AP2-H (J15.45)
PC2: AP2-Core (IC1.34 JP3.6), AP2-H (J6.6 R262.2 R265.1)
PC3: AP2-Core (IC1.35 JP3.5), AP2-H (J6.5 R263.2 R266.1)
PC4: AP2-Core (IC1.54 JP5.48), AP2-H (J21.48)
PC5: AP2-Core (IC1.55 JP5.47), AP2-H (J21.47)
PC6: AP2-Core (IC1.115 JP5.8), AP2-H (J21.8)
PC7: AP2-Core (IC1.116 JP4.7), AP2-H (J8.7)
PC8: AP2-Core (IC1.117 JP4.8), AP2-H (J8.8 R163.1)
PC9: AP2-Core (IC1.118 JP5.5), AP2-H (J21.5 R244.1)
PC10: AP2-Core (IC1.139 JP2.3), AP2-H (J15.3 LED63.K R241.2 U93.4)
PC11: AP2-Core (IC1.140 JP2.4), AP2-H (J15.4 LED64.K R247.2 U95.4)
PC12: AP2-Core (IC1.141 JP1.5), AP2-H (J3.5 LED3#2.K R30.2 U10.4)
PC13: AP2-Core (IC1.8 JP2.33), AP2-H (J15.33)
PD0: AP2-Core (IC1.142 JP1.6), AP2-H (J3.6 LED4.K R36.2 U12.4)
PD1: AP2-Core (IC1.143 JP2.5), AP2-H (J15.5 LED53.K R229.2 U88.4)
PD2: AP2-Core (IC1.144 JP2.6), AP2-H (J15.6 LED54.K R233.2 U91.4)
PD3: AP2-Core (IC1.145 JP1.7), AP2-H (J3.7 LED5.K R41.2 U14.4)
PD4: AP2-Core (IC1.146 JP1.8), AP2-H (J3.8 LED6.K R45.2 U17.4)
PD5: AP2-Core (IC1.147 JP2.7), AP2-H (J15.7 LED52.K R220.2 U83.4)
PD6: AP2-Core (IC1.150 JP2.8), AP2-H (J15.8 LED51.K R225.2 U86.4)
PD7: AP2-Core (IC1.151 JP1.9), AP2-H (J3.9 LED15.K R53.2 U19.4)
PD8: AP2-Core (IC1.96 JP5.19), AP2-H (J21.19 R97.1)
PD9: AP2-Core (IC1.97 JP5.20), AP2-H (J21.20 R108.1)
PD10: AP2-Core (IC1.98 JP5.17), AP2-H (J21.17 R120.1)
PD11: AP2-Core (IC1.99 JP5.18), AP2-H (J21.18 R64.1)
PD12: AP2-Core (IC1.100 JP5.15), AP2-H (J21.15 R68.1)
PD13: AP2-Core (IC1.101 JP5.16), AP2-H (J21.16 R79.1)
PD14: AP2-Core (IC1.104 JP5.13), AP2-H (J21.13 R85.1)
PD15: AP2-Core (IC1.105 JP5.14), AP2-H (J21.14 R37.1)
PE0: AP2-Core (IC1.169 JP2.22), AP2-H (J15.22 LED44.K R190.2 U72.4)
PE1: AP2-Core (IC1.170 JP2.23), AP2-H (J15.23 LED43.K R181.2 U69.4)
PE2: AP2-Core (IC1.1 JP2.27), AP2-H (J15.27 LED42.K R168.2 U65.4)
PE3: AP2-Core (IC1.2 JP2.30), AP2-H (J15.29 LED30.K R101.2 U40.4)
PE4: AP2-Core (IC1.3 JP2.29), AP2-H (J15.30 LED29.K R94.2 U36.4)
PE5: AP2-Core (IC1.4 JP2.32), AP2-H (J15.32 J32.1 U1.9)
PE6: AP2-Core (IC1.5 JP2.31), AP2-H (J15.31 LED32.K R117.2 U44.4)
PE7: AP2-Core (IC1.68 JP5.42), AP2-H (J21.42 R186.1)
PE8: AP2-Core (IC1.69 JP5.41), AP2-H (J21.41 R192.1)
PE9: AP2-Core (IC1.70 JP5.40), AP2-H (J21.40 R198.1)
PE10: AP2-Core (IC1.73 JP5.39), AP2-H (J21.39 R210.1)
PE11: AP2-Core (IC1.74 JP5.38), AP2-H (J21.38 R222.1)
PE12: AP2-Core (IC1.75 JP5.37), AP2-H (J21.37 R171.1)
PE13: AP2-Core (IC1.76 JP5.36), AP2-H (J21.36 R157.1)
PE14: AP2-Core (IC1.77 JP5.35), AP2-H (J21.35 R145.1)
PE15: AP2-Core (IC1.78 JP5.34), AP2-H (J21.34 R91.1)
PF0: AP2-Core (IC1.16 JP2.37), AP2-H (J15.37 LED41.K R161.2 U61.4)
PF1: AP2-Core (IC1.17 JP2.40), AP2-H (J15.40 LED40.K R149.2 U58.4)
PF2: AP2-Core (IC1.18 JP2.39), AP2-H (J15.39 LED31.K R123.2 U47.4)
PF3: AP2-Core (IC1.19 JP2.42), AP2-H (J15.42 LED39.K R143.2 U56.4)
PF4: AP2-Core (IC1.20 JP2.41), AP2-H (J15.41 LED34.K R135.2 U54.4)
PF5: AP2-Core (IC1.21 JP3.2), AP2-H (J6.2 LED33.K R129.2 U50.4)
PF6: AP2-Core (IC1.24 JP3.1), AP2-H (J6.1 J32.3 U6.1)
PF7: AP2-Core (IC1.25 JP2.44), AP2-H (J15.44 U6.3)
PF8: AP2-Core (IC1.26 JP2.43), AP2-H (J11.3 J15.43 U6.5)
PF9: AP2-Core (IC1.27 JP3.4), AP2-H (J6.4 J12.3 U6.13)
PF10: AP2-Core (IC1.28 JP3.3), AP2-H (J6.3 R31.1)
PF11: AP2-Core (IC1.59 JP5.45), AP2-H (J21.45 R132.1)
PF12: AP2-Core (IC1.60 JP6.4), AP2-H (J9.4 R11#2.1)
PF13: AP2-Core (IC1.63 JP6.3), AP2-H (J9.3 R23.1)
PF14: AP2-Core (IC1.64 JP5.44), AP2-H (J21.44 R126.1)
PF15: AP2-Core (IC1.65 JP5.43), AP2-H (J21.43 R140.1)
PG0: AP2-Core (IC1.66 JP6.2), AP2-H (J9.2 LED1.K R10#2.2 U3.4)
PG1: AP2-Core (IC1.67 JP6.1), AP2-H (J9.1 LED2.K R14#2.2 U7.4)
PG2: AP2-Core (IC1.106 JP5.11), AP2-H (J21.11 R42.1)
PG3: AP2-Core (IC1.107 JP5.12), AP2-H (J21.12 R50.1)
PG4: AP2-Core (IC1.108 JP5.9), AP2-H (J21.9 R230.1)
PG5: AP2-Core (IC1.109 JP5.10), AP2-H (J21.10 R226.1)
PG6: AP2-Core (IC1.110 JP4.9), AP2-H (J8.9 R54.1)
PG7: AP2-Core (IC1.111 JP4.10), AP2-H (J8.10 R7#2.1)
PG8: AP2-Core (IC1.112 JP5.7), AP2-H (J21.7 R238.1)
PG9: AP2-Core (IC1.152 JP1.10), AP2-H (J3.10 LED16.K R57.2 U21.4)
PG10: AP2-Core (IC1.153 JP2.9), AP2-H (J15.9 LED49.K R196.2 U75.4)
PG11: AP2-Core (IC1.154 JP2.10), AP2-H (J15.10 LED50.K R202.2 U79.4)
PG12: AP2-Core (IC1.155 JP2.11), AP2-H (J15.11 LED17.K R67.2 U23.4)
PG13: AP2-Core (IC1.156 JP2.12), AP2-H (J15.12 LED18.K R72.2 U26.4)
PG14: AP2-Core (IC1.157 JP2.13), AP2-H (J15.13 LED19.K R82.2 U30.4)
PG15: AP2-Core (IC1.160 JP2.14), AP2-H (J15.14 LED20.K R88.2 U33.4)
PH2: AP2-Core (IC1.43 JP3.7), AP2-H (J6.7 R89.1)
PH3: AP2-Core (IC1.44 JP2.50), AP2-H (J15.50 R95.1)
PH4: AP2-Core (IC1.45 JP2.49), AP2-H (J15.49 R102.1)
PH5: AP2-Core (IC1.46 JP6.10), AP2-H (J9.10 R118.1)
PH6: AP2-Core (IC1.83 JP5.31), AP2-H (J21.31 R124.1)
PH7: AP2-Core (IC1.84 JP5.30), AP2-H (J21.30 R130.1)
PH8: AP2-Core (IC1.85 JP5.29), AP2-H (J21.29 R150.2 U59.4)
PH9: AP2-Core (IC1.86 JP5.28), AP2-H (J21.28 R162.2 U62.4)
PH10: AP2-Core (IC1.87 JP5.27), AP2-H (J21.27 R169.2 U66.4)
PH11: AP2-Core (IC1.88 JP5.26), AP2-H (J4.1 J13.3 J21.26 U6.11)
PH12: AP2-Core (IC1.89 JP5.25), AP2-H (J21.25 R191.2 U73.4)
PH13: AP2-Core (IC1.128 JP4.4), AP2-H (J8.4 R197.2 U76.4)
PH14: AP2-Core (IC1.129 JP5.1), AP2-H (J21.1 R203.2 U80.4)
PH15: AP2-Core (IC1.130 JP5.2), AP2-H (J21.2 R221.2 U84.4)
PI0: AP2-Core (IC1.131 IC5.4 JP4.1), AP2-H (J8.1)
PI1: AP2-Core (IC1.132 IC5.2 JP4.2), AP2-H (J8.2)
PI2: AP2-Core (IC1.133 IC5.8 JP2.1), AP2-H (J15.1)
PI3: AP2-Core (IC1.134 IC5.1 JP2.2), AP2-H (J15.2)
PI4: AP2-Core (IC1.173 IC5.3 JP2.24), AP2-H (J15.24)
PI5: AP2-Core (IC1.174 IC5.5 JP2.25), AP2-H (J15.25)
PI6: AP2-Core (IC1.175 JP2.26), AP2-H (J4.3 J14.3 J15.26 U6.9)
PI7: AP2-Core (IC1.176 JP2.28), AP2-H (J15.28 R248.1 R249.1)
PI8: AP2-Core (IC1.7 JP2.34), AP2-H (J15.34)
PI9: AP2-Core (IC1.11 JP2.36), AP2-H (J15.36)
PI10: AP2-Core (IC1.12 JP2.35), AP2-H (J15.35)
PI11: AP2-Core (IC1.13 JP2.38), AP2-H (J15.38)
USB_D+: AP2-Core (R15#1.1 R16#1.2 USB1#1.3), AP2-H (R250.1 R252.2 USB1#2.3)
USB_D-: AP2-Core (R14#1.2 USB1#1.2), AP2-H (R251.2 USB1#2.2)
VBAT: AP2-Core (IC1.6 JP3.10 R10#1.1), AP2-H (J6.10)